# EAGLE schematic GTA04b7 (EAGLE 7.6.0), part 3 of 3
## Sheet 32 of 38
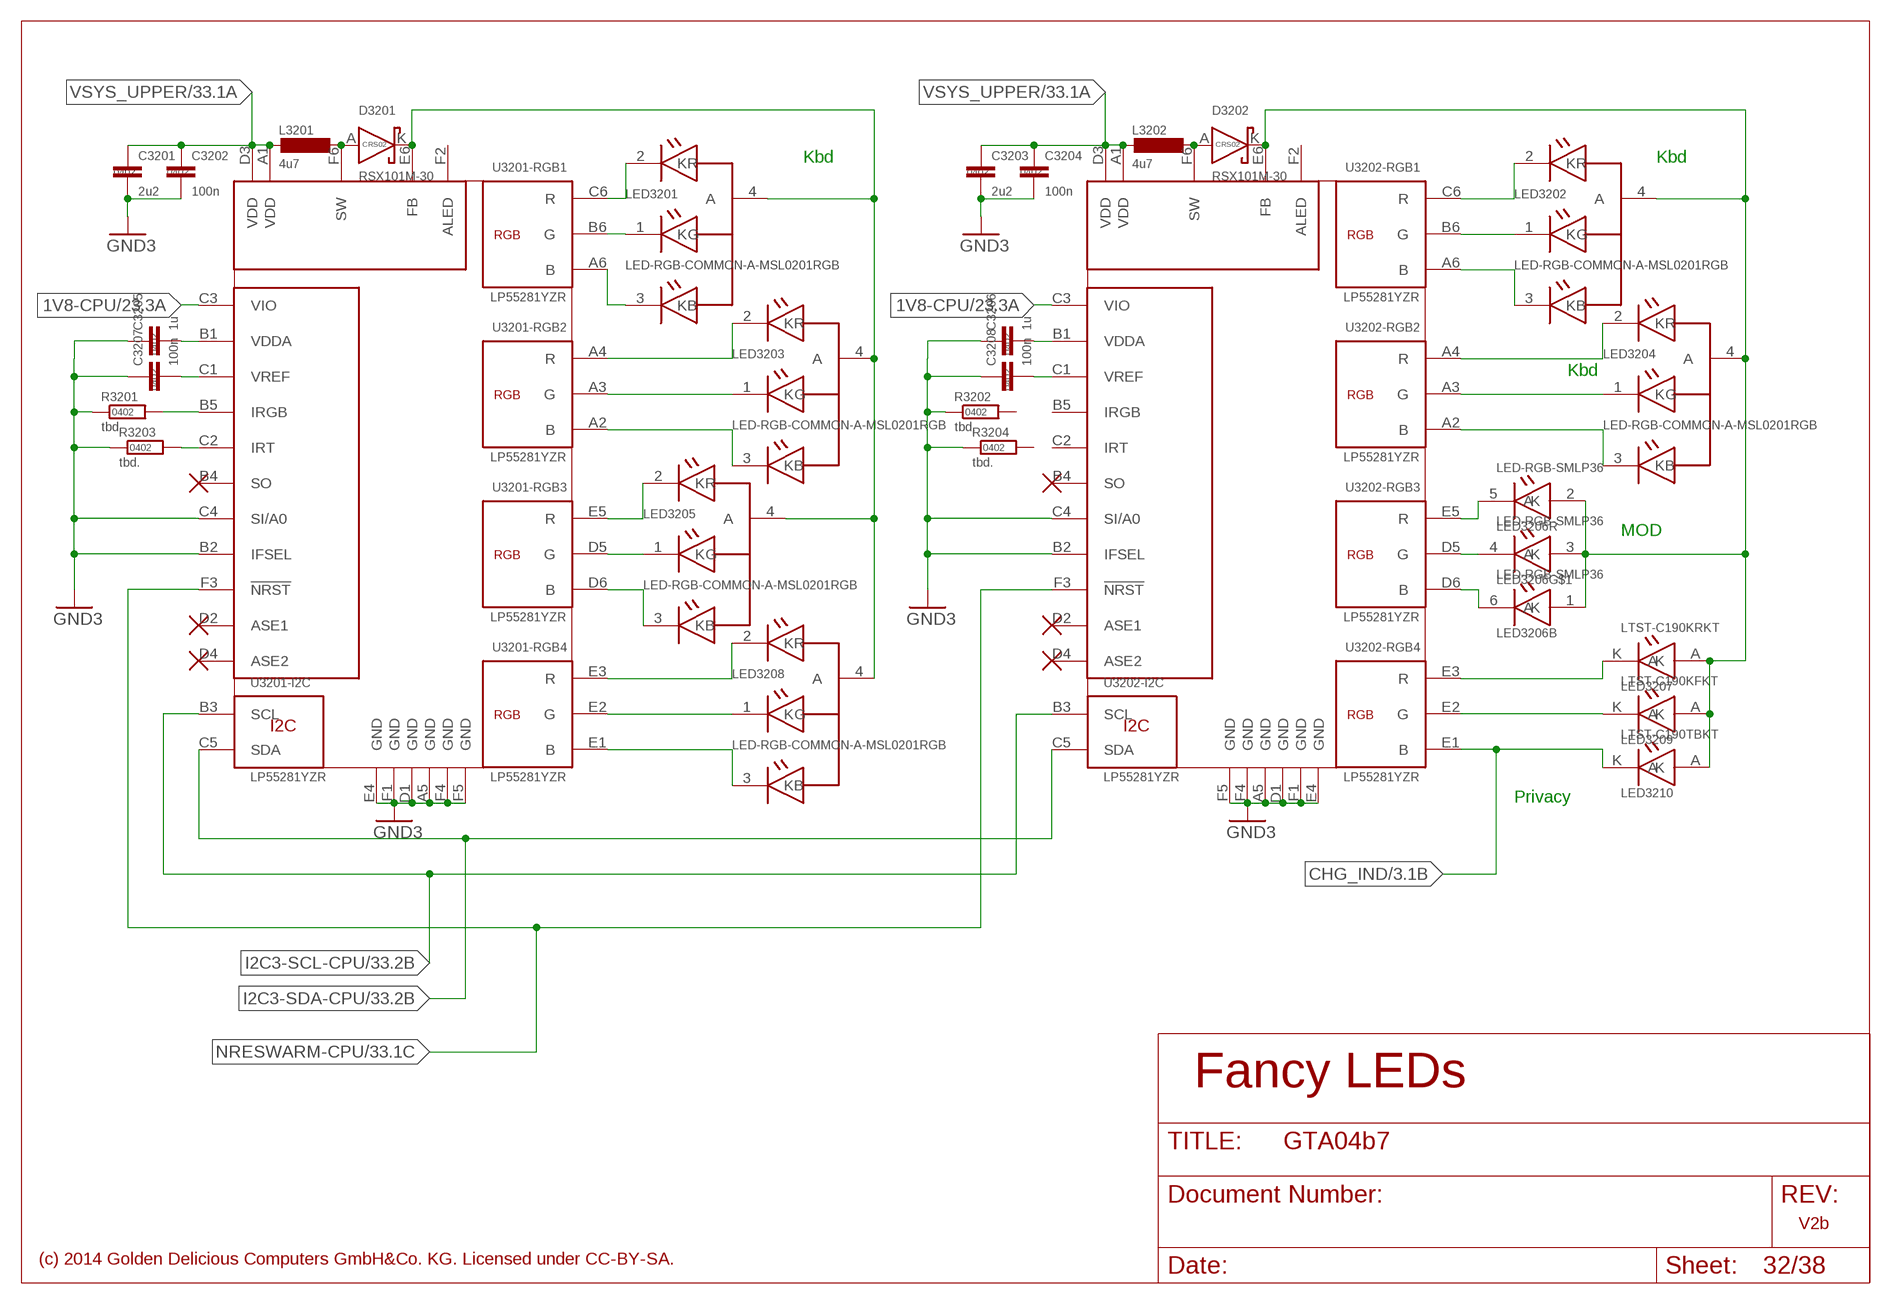
[diagram p35: schematic, sheet 32]

### Parts
C3201  2u2  C0402  [SMD-0402]
C3202  100n  C0402  [SMD-0402]
C3203  2u2  C0402  [SMD-0402]
C3204  100n  C0402  [SMD-0402]
C3205  1u  C0402  [SMD-0402]
C3206  1u  C0402  [SMD-0402]
C3207  100n  C0402  [SMD-0402]
C3208  100n  C0402  [SMD-0402]
D3201  RSX101M-30  D-SCHOTTKY-CRS02  [CRS02]
D3202  RSX101M-30  D-SCHOTTKY-CRS02  [CRS02]
L3201  4u7  L0806  [SMD-0806]
L3202  4u7  L0806  [SMD-0806]
LED3201  LED-RGB-COMMON-A-MSL0201RGB  [MSL0201RGB]
LED3202  LED-RGB-COMMON-A-MSL0201RGB  [MSL0201RGB]
LED3203  LED-RGB-COMMON-A-MSL0201RGB  [MSL0201RGB]
LED3204  LED-RGB-COMMON-A-MSL0201RGB  [MSL0201RGB]
LED3205  LED-RGB-COMMON-A-MSL0201RGB  [MSL0201RGB]
LED3206  LED-RGB-SMLP36  [SMLP36RGB2W3]
LED3207  LTST-C190KRKT  LED-0603  [SMD-0603D]
LED3208  LED-RGB-COMMON-A-MSL0201RGB  [MSL0201RGB]
LED3209  LTST-C190KFKT  LED-0603  [SMD-0603D]
LED3210  LTST-C190TBKT  LED-0603  [SMD-0603D]
R3201  tbd.  R0402  [SMD-0402]
R3202  tbd.  R0402  [SMD-0402]
R3203  tbd.  R0402  [SMD-0402]
R3204  tbd.  R0402  [SMD-0402]
U3201  LP55281YZR  [YZR0036]
U3202  LP55281YZR  [YZR0036]

### Nets
1V8-CPU: U3201.C3(VIO) U3202.C3(VIO) ; also sheet 23,24,25,27,29,30
CHG_IND: LED3210.K U3202.E1(-RGB4:B) ; also sheet 3,20
GND3 [GND]: C3201.2 C3202.2 C3203.2 C3204.2 C3205.1 C3206.1 C3207.1 C3208.1 R3201.1 R3202.1 R3203.1 R3204.1 U3201.A5(GND_RGB1:GND) U3201.B2(IFSEL) U3201.C4(SI/A0) U3201.D1(GNDA:GND) U3201.E4(GND@1:GND) U3201.F1(GND@2:GND) U3201.F4(GND_RGB2:GND) U3201.F5(GND_SW:GND) U3202.A5(GND_RGB1:GND) U3202.B2(IFSEL) U3202.C4(SI/A0) U3202.D1(GNDA:GND) U3202.E4(GND@1:GND) U3202.F1(GND@2:GND) U3202.F4(GND_RGB2:GND) U3202.F5(GND_SW:GND) ; supply symbol labelled GND-3 ; also sheet 22,23,24,25,27,28,29,30,31,33
I2C3-SCL-CPU: U3201.B3(-I2C:SCL) U3202.B3(-I2C:SCL) ; also sheet 26,30,31,33
I2C3-SDA-CPU: U3201.C5(-I2C:SDA) U3202.C5(-I2C:SDA) ; also sheet 26,30,31,33
LED2503: LED3203.1(KG) U3201.A3(-RGB2:G)
LED2504: LED3205.1(KG) U3201.D5(-RGB3:G)
LED2505: LED3208.1(KG) U3201.E2(-RGB4:G)
LED2507: LED3204.1(KG) U3202.A3(-RGB2:G)
N$69: LED3206.4(K) U3202.D5(-RGB3:G)
N$70: LED3206.5(R:K) U3202.E5(-RGB3:R)
N$71: LED3206.6(B:K) U3202.D6(-RGB3:B)
N$85: LED3201.1(KG) U3201.B6(-RGB1:G)
N$89: LED3201.3(KB) U3201.A6(-RGB1:B)
N$90: LED3201.2(KR) U3201.C6(-RGB1:R)
N$91: LED3203.2(KR) U3201.A4(-RGB2:R)
N$94: LED3207.K U3202.E3(-RGB4:R)
N$96: LED3203.3(KB) U3201.A2(-RGB2:B)
N$98: LED3205.2(KR) U3201.E5(-RGB3:R)
N$100: LED3209.K U3202.E2(-RGB4:G)
N$101: LED3205.3(KB) U3201.D6(-RGB3:B)
N$102: LED3208.2(KR) U3201.E3(-RGB4:R)
N$104: LED3208.3(KB) U3201.E1(-RGB4:B)
N$105: LED3202.2(KR) U3202.C6(-RGB1:R)
N$106: LED3202.1(KG) U3202.B6(-RGB1:G)
N$107: LED3202.3(KB) U3202.A6(-RGB1:B)
N$108: LED3204.2(KR) U3202.A4(-RGB2:R)
N$113: LED3204.3(KB) U3202.A2(-RGB2:B)
N$115: D3201.K LED3201.4(A) LED3203.4(A) LED3205.4(A) LED3208.4(A) U3201.E6(FB)
N$116: D3202.K LED3202.4(A) LED3204.4(A) LED3206.1(B:A) LED3206.2(R:A) LED3206.3(A) LED3207.A LED3209.A LED3210.A U3202.E6(FB)
N$117: D3201.A L3201.1 U3201.F6(SW)
N$118: D3202.A L3202.1 U3202.F6(SW)
N$203: C3207.2 U3201.C1(VREF)
N$204: C3205.2 U3201.B1(VDDA)
N$206: R3203.2 U3201.C2(IRT)
N$207: R3201.2 U3201.B5(IRGB)
N$209: C3206.2 U3202.B1(VDDA)
N$210: C3208.2 U3202.C1(VREF)
NRESWARM-CPU: U3201.F3(!NRST) U3202.F3(!NRST) ; also sheet 26,33
VSYS_UPPER: C3201.1 C3202.1 C3203.1 C3204.1 L3201.2 L3202.2 U3201.A1(VDD) U3201.D3(VDD) U3202.A1(VDD) U3202.D3(VDD) ; also sheet 28,31,33
Unconnected: R3202.2 R3204.2 U3201.B4(SO) U3201.D2(ASE1) U3201.D4(ASE2) U3201.F2(ALED) U3202.B4(SO) U3202.B5(IRGB) U3202.C2(IRT) U3202.D2(ASE1) U3202.D4(ASE2) U3202.F2(ALED)

### Notes on the sheet
- Kbd | Kbd
- Kbd
- MOD
- Privacy
- Fancy LEDs
- V2b
- (c) 2014 Golden Delicious Computers GmbH&Co. KG. Licensed under CC-BY-SA.

## Sheet 33 of 38
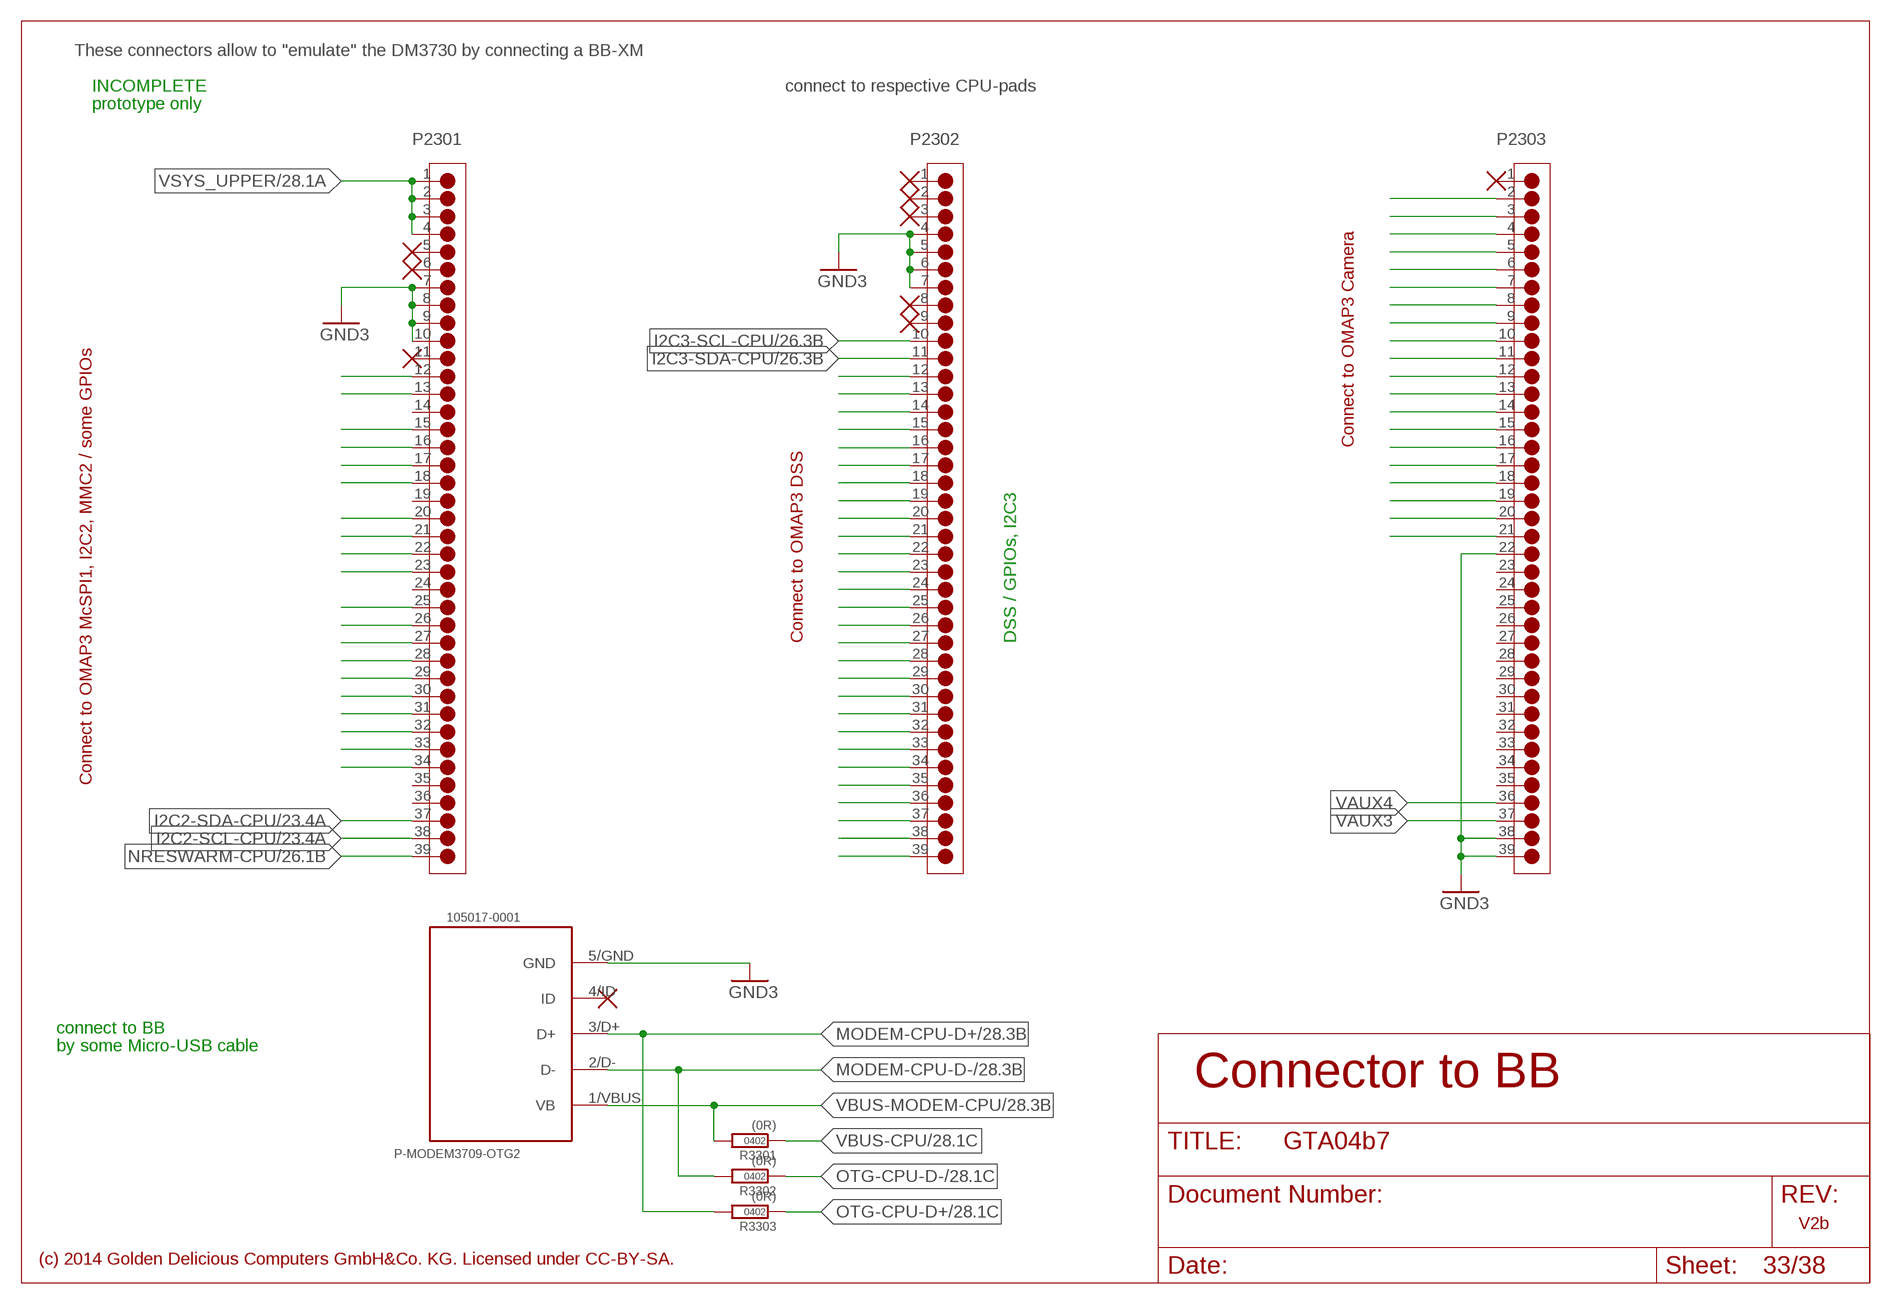
[diagram p36: schematic, sheet 33]

### Parts
P3301  FH23-39S  [FH23-39S-0.3SHW(0.5)]
P3302  FH23-39S  [FH23-39S-0.3SHW(0.5)]
P3303  FH23-39S  [FH23-39S-0.3SHW(0.5)]
P-MODEM3709  105017-0001  USB-AB-NEW-105017-0001  [105017-0001]
R3301  (0R)  R0402  [SMD-0402]  (not fitted in variant Full)  (not fitted in variant BB-XM)
R3302  (0R)  R0402  [SMD-0402]  (not fitted in variant Full)  (not fitted in variant BB-XM)
R3303  (0R)  R0402  [SMD-0402]  (not fitted in variant Full)  (not fitted in variant BB-XM)

### Nets
GND3 [GND]: P3303.22 P3303.38 P3303.39 P-MODEM3709.5/GND(-OTG2:GND) ; supply symbol labelled GND-3 ; also sheet 22,23,24,25,27,28,29,30,31,32
I2C2-SCL-CPU: P3301.38 ; also sheet 23,24,25,26
I2C2-SDA-CPU: P3301.37 ; also sheet 23,24,25,26
I2C3-SCL-CPU: P3302.10 ; also sheet 26,30,31,32
I2C3-SDA-CPU: P3302.11 ; also sheet 26,30,31,32
MODEM-CPU-D+: P-MODEM3709.3/D+(-OTG2:D+) R3303.2 ; also sheet 28
MODEM-CPU-D-: P-MODEM3709.2/D-(-OTG2:D-) R3302.2 ; also sheet 28
N$205: P3303.2
N$216: P3301.7 P3301.8 P3301.9 P3301.10
N$217: P3301.13
N$218: P3301.12
N$219: P3301.16
N$220: P3301.17
N$222: P3301.18
N$223: P3301.15
N$225: P3301.21
N$226: P3301.22
N$227: P3301.23
N$228: P3301.20
N$230: P3301.26
N$231: P3301.27
N$232: P3301.28
N$233: P3301.29
N$234: P3301.30
N$235: P3301.31
N$236: P3301.32
N$237: P3301.33
N$238: P3301.34
N$239: P3301.25
N$242: P3302.4 P3302.5 P3302.6 P3302.7
N$245: P3302.12
N$246: P3302.13
N$247: P3302.14
N$250: P3302.15
N$251: P3302.16
N$252: P3302.17
N$253: P3302.18
N$256: P3302.19
N$257: P3302.20
N$258: P3302.21
N$259: P3302.22
N$260: P3302.23
N$261: P3302.24
N$262: P3302.25
N$263: P3302.26
N$264: P3302.27
N$265: P3302.28
N$266: P3302.29
N$267: P3302.30
N$268: P3302.31
N$270: P3302.32
N$271: P3302.33
N$272: P3302.34
N$273: P3302.35
N$274: P3302.36
N$275: P3302.37
N$276: P3302.38
N$277: P3302.39
N$278: P3303.3
N$279: P3303.4
N$280: P3303.5
N$281: P3303.6
N$282: P3303.7
N$283: P3303.8
N$284: P3303.9
N$285: P3303.10
N$286: P3303.11
N$287: P3303.12
N$288: P3303.13
N$289: P3303.14
N$290: P3303.15
N$291: P3303.16
N$292: P3303.17
N$293: P3303.18
N$294: P3303.19
N$295: P3303.20
N$296: P3303.21
NRESWARM-CPU: P3301.39 ; also sheet 26,32
OTG-CPU-D+: R3303.1 ; also sheet 28
OTG-CPU-D-: R3302.1 ; also sheet 28
VAUX3: P3303.37
VAUX4: P3303.36
VBUS-CPU: R3301.1 ; also sheet 28
VBUS-MODEM-CPU: P-MODEM3709.1/VBUS(-OTG2:VB) R3301.2 ; also sheet 2,28
VSYS_UPPER: P3301.1 P3301.2 P3301.3 P3301.4 ; also sheet 28,31,32
Unconnected: P3301.5 P3301.6 P3301.11 P3301.14 P3301.19 P3301.24 P3301.35 P3301.36 P3302.1 P3302.2 P3302.3 P3302.8 P3302.9 P3303.1 P3303.23 P3303.24 P3303.25 P3303.26 P3303.27 P3303.28 P3303.29 P3303.30 P3303.31 P3303.32 P3303.33 P3303.34 P3303.35 P-MODEM3709.4/ID(-OTG2:ID)

### Notes on the sheet
- These connectors allow to "emulate" the DM3730 by connecting a BB-XM
- INCOMPLETE | connect to respective CPU-pads
- prototype only
- P2301 | P2302 | P2303
- Connect to OMAP3 Camera
- Connect to OMAP3 DSS | DSS / GPIOs, I2C3
- Connect to OMAP3 McSPI1, I2C2, MMC2 / some GPIOs
- connect to BB
- by some Micro-USB cable
- Connector to BB
- V2b
- (c) 2014 Golden Delicious Computers GmbH&Co. KG. Licensed under CC-BY-SA.

## Sheet 34 of 38
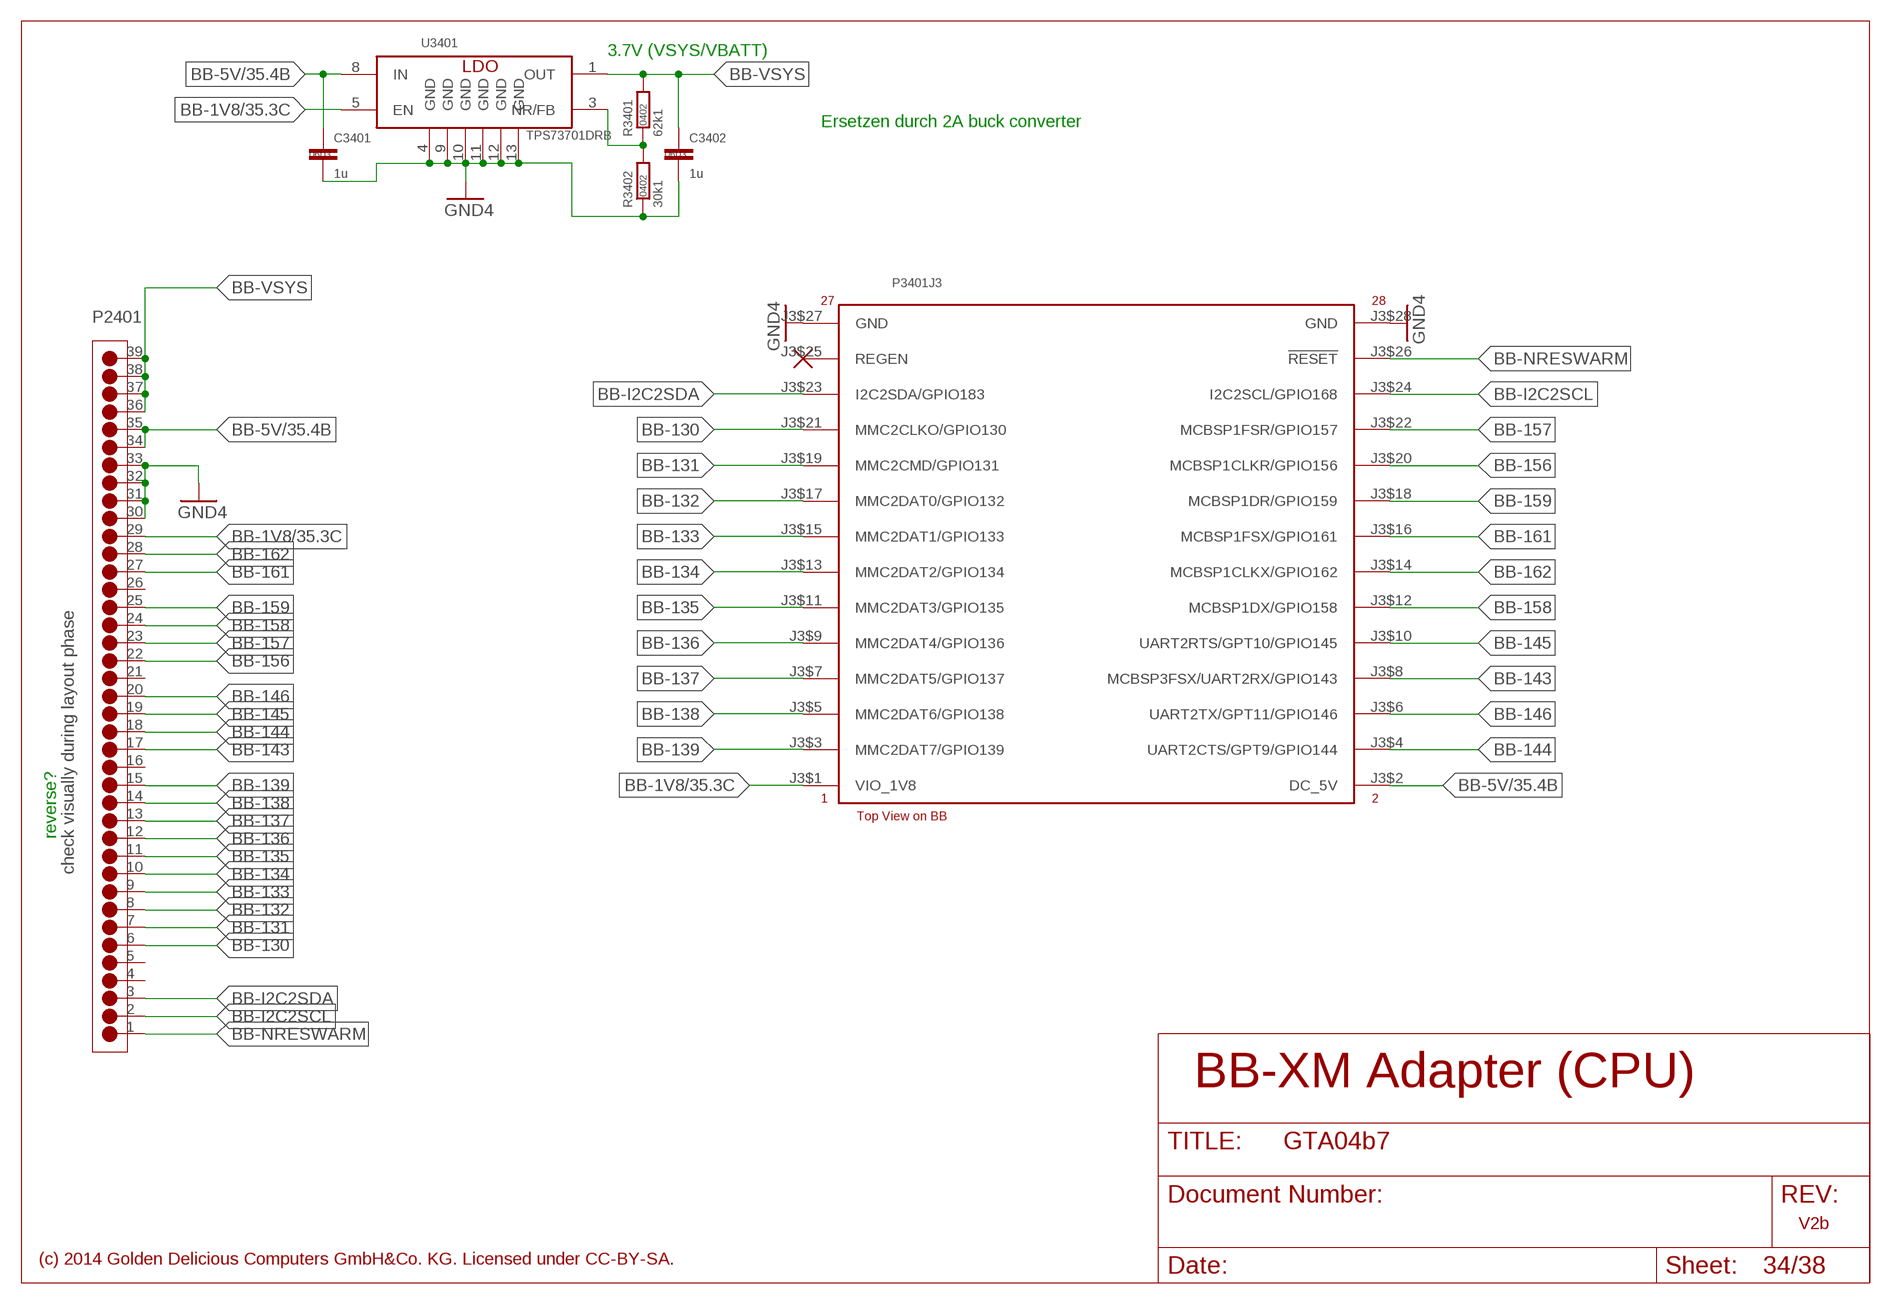
[diagram p37: schematic, sheet 34]

### Parts
C3401  1u  C0603  [SMD-0603]
C3402  1u  C0603  [SMD-0603]
P3401  BEAGLEBOARD  [BEAGLEBOARD]
P3402  FH23-39S  [FH23-39S-0.3SHW(0.5)]
R3401  62k1  R0402  [SMD-0402]
R3402  30k1  R0402  [SMD-0402]
U3401  TPS73701DRB  TPS73733DRB  [SON-3X3]

### Nets
BB-1V8: P3401.J3$1(J3:VIO_1V8) P3402.29 U3401.5(EN) ; also sheet 35
BB-5V: C3401.1 P3401.J3$2(J3:DC_5V) P3402.34 P3402.35 U3401.8(IN) ; also sheet 35
BB-130: P3401.J3$21(J3:MMC2CLKO/GPIO130) P3402.6
BB-131: P3401.J3$19(J3:MMC2CMD/GPIO131) P3402.7
BB-132: P3401.J3$17(J3:MMC2DAT0/GPIO132) P3402.8
BB-133: P3401.J3$15(J3:MMC2DAT1/GPIO133) P3402.9
BB-134: P3401.J3$13(J3:MMC2DAT2/GPIO134) P3402.10
BB-135: P3401.J3$11(J3:MMC2DAT3/GPIO135) P3402.11
BB-136: P3401.J3$9(J3:MMC2DAT4/GPIO136) P3402.12
BB-137: P3401.J3$7(J3:MMC2DAT5/GPIO137) P3402.13
BB-138: P3401.J3$5(J3:MMC2DAT6/GPIO138) P3402.14
BB-139: P3401.J3$3(J3:MMC2DAT7/GPIO139) P3402.15
BB-143: P3401.J3$8(J3:MCBSP3FSX/UART2RX/GPIO143) P3402.17
BB-144: P3401.J3$4(J3:UART2CTS/GPT9/GPIO144) P3402.18
BB-145: P3401.J3$10(J3:UART2RTS/GPT10/GPIO145) P3402.19
BB-146: P3401.J3$6(J3:UART2TX/GPT11/GPIO146) P3402.20
BB-156: P3401.J3$20(J3:MCBSP1CLKR/GPIO156) P3402.22
BB-157: P3401.J3$22(J3:MCBSP1FSR/GPIO157) P3402.23
BB-158: P3401.J3$12(J3:MCBSP1DX/GPIO158) P3402.24
BB-159: P3401.J3$18(J3:MCBSP1DR/GPIO159) P3402.25
BB-161: P3401.J3$16(J3:MCBSP1FSX/GPIO161) P3402.27
BB-162: P3401.J3$14(J3:MCBSP1CLKX/GPIO162) P3402.28
BB-I2C2SCL: P3401.J3$24(J3:I2C2SCL/GPIO168) P3402.2
BB-I2C2SDA: P3401.J3$23(J3:I2C2SDA/GPIO183) P3402.3
BB-NRESWARM: P3401.J3$26(J3:!RESET) P3402.1
BB-VSYS: C3402.1 P3402.36 P3402.37 P3402.38 P3402.39 R3401.2 U3401.1(OUT)
GND4: C3401.2 C3402.2 P3401.J3$27(J3:GND) P3401.J3$28(J3:GND) P3402.30 P3402.31 P3402.32 P3402.33 R3402.1 U3401.4(GND) U3401.9(GND) U3401.10(GND) U3401.11(GND) U3401.12(GND) U3401.13(GND) ; supply symbol labelled GND-4 ; also sheet 35,36
N$68: R3401.1 R3402.2 U3401.3(NR/FB)
Unconnected: P3401.J3$25(J3:REGEN) P3402.4 P3402.5 P3402.16 P3402.21 P3402.26

### Notes on the sheet
- 3.7V (VSYS/VBATT)
- Ersetzen durch 2A buck converter
- P2401
- reverse?
- check visually during layout phase
- BB-XM Adapter (CPU)
- V2b
- (c) 2014 Golden Delicious Computers GmbH&Co. KG. Licensed under CC-BY-SA.

## Sheet 35 of 38
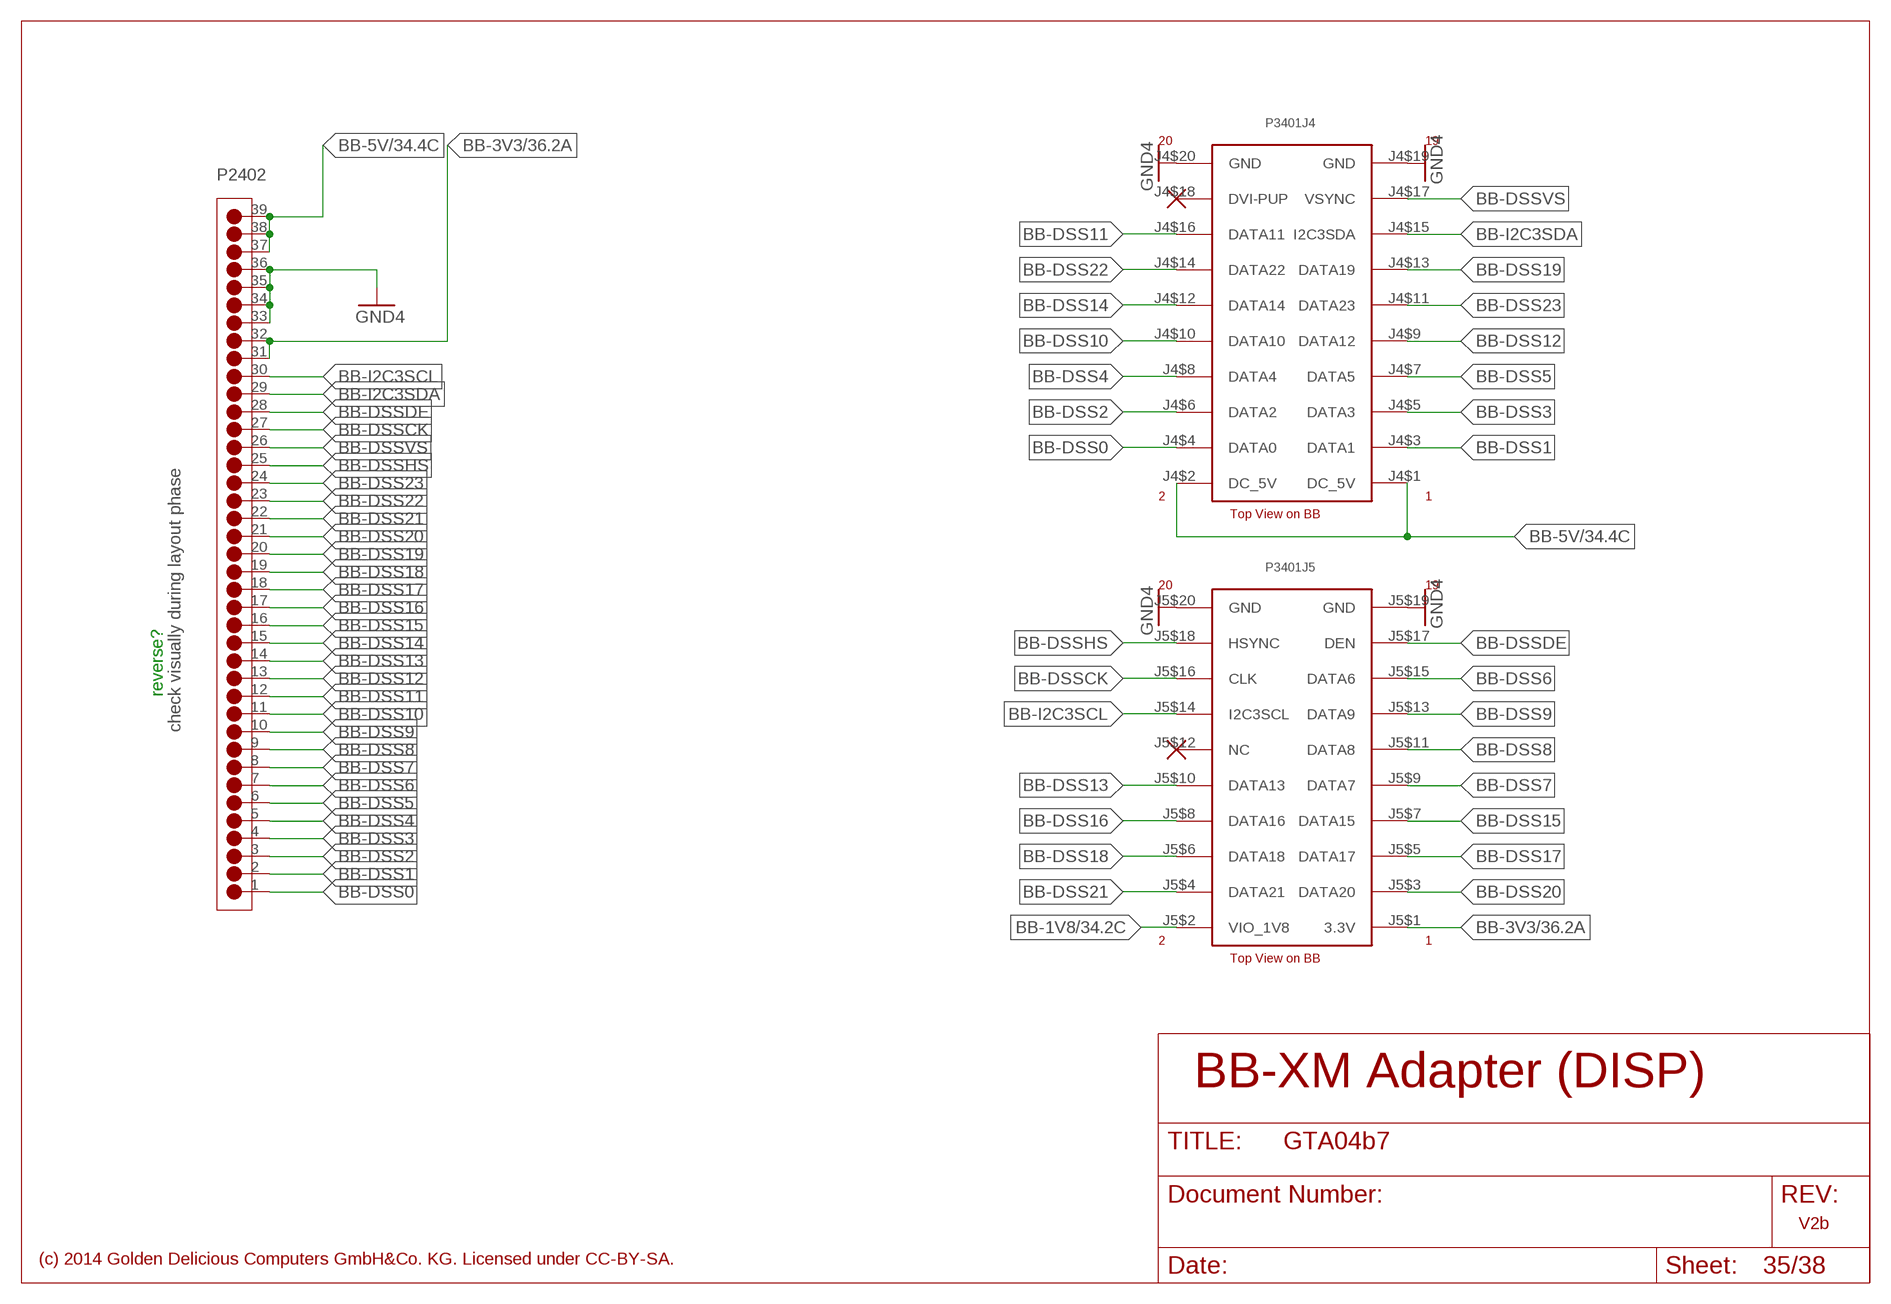
[diagram p38: schematic, sheet 35]

### Parts
P3501  FH23-39S  [FH23-39S-0.3SHW(0.5)]

### Nets
BB-1V8: P3401.J5$2(J5:VIO_1V8) ; also sheet 34
BB-3V3: P3401.J5$1(J5:3.3V) P3501.31 P3501.32 ; also sheet 36
BB-5V: P3401.J4$1(J4:DC_5V) P3401.J4$2(J4:DC_5V) P3501.37 P3501.38 P3501.39 ; also sheet 34
BB-DSS0: P3401.J4$4(J4:DATA0) P3501.1
BB-DSS1: P3401.J4$3(J4:DATA1) P3501.2
BB-DSS2: P3401.J4$6(J4:DATA2) P3501.3
BB-DSS3: P3401.J4$5(J4:DATA3) P3501.4
BB-DSS4: P3401.J4$8(J4:DATA4) P3501.5
BB-DSS5: P3401.J4$7(J4:DATA5) P3501.6
BB-DSS6: P3401.J5$15(J5:DATA6) P3501.7
BB-DSS7: P3401.J5$9(J5:DATA7) P3501.8
BB-DSS8: P3401.J5$11(J5:DATA8) P3501.9
BB-DSS9: P3401.J5$13(J5:DATA9) P3501.10
BB-DSS10: P3401.J4$10(J4:DATA10) P3501.11
BB-DSS11: P3401.J4$16(J4:DATA11) P3501.12
BB-DSS12: P3401.J4$9(J4:DATA12) P3501.13
BB-DSS13: P3401.J5$10(J5:DATA13) P3501.14
BB-DSS14: P3401.J4$12(J4:DATA14) P3501.15
BB-DSS15: P3401.J5$7(J5:DATA15) P3501.16
BB-DSS16: P3401.J5$8(J5:DATA16) P3501.17
BB-DSS17: P3401.J5$5(J5:DATA17) P3501.18
BB-DSS18: P3401.J5$6(J5:DATA18) P3501.19
BB-DSS19: P3401.J4$13(J4:DATA19) P3501.20
BB-DSS20: P3401.J5$3(J5:DATA20) P3501.21
BB-DSS21: P3401.J5$4(J5:DATA21) P3501.22
BB-DSS22: P3401.J4$14(J4:DATA22) P3501.23
BB-DSS23: P3401.J4$11(J4:DATA23) P3501.24
BB-DSSCK: P3401.J5$16(J5:CLK) P3501.27
BB-DSSDE: P3401.J5$17(J5:DEN) P3501.28
BB-DSSHS: P3401.J5$18(J5:HSYNC) P3501.25
BB-DSSVS: P3401.J4$17(J4:VSYNC) P3501.26
BB-I2C3SCL: P3401.J5$14(J5:I2C3SCL) P3501.30
BB-I2C3SDA: P3401.J4$15(J4:I2C3SDA) P3501.29
GND4: P3401.J4$19(J4:GND) P3401.J4$20(J4:GND) P3401.J5$19(J5:GND) P3401.J5$20(J5:GND) P3501.33 P3501.34 P3501.35 P3501.36 ; supply symbol labelled GND-4 ; also sheet 34,36
Unconnected: P3401.J4$18(J4:DVI-PUP) P3401.J5$12(J5:NC)

### Notes on the sheet
- P2402
- reverse?
- check visually during layout phase
- BB-XM Adapter (DISP)
- V2b
- (c) 2014 Golden Delicious Computers GmbH&Co. KG. Licensed under CC-BY-SA.

## Sheet 36 of 38
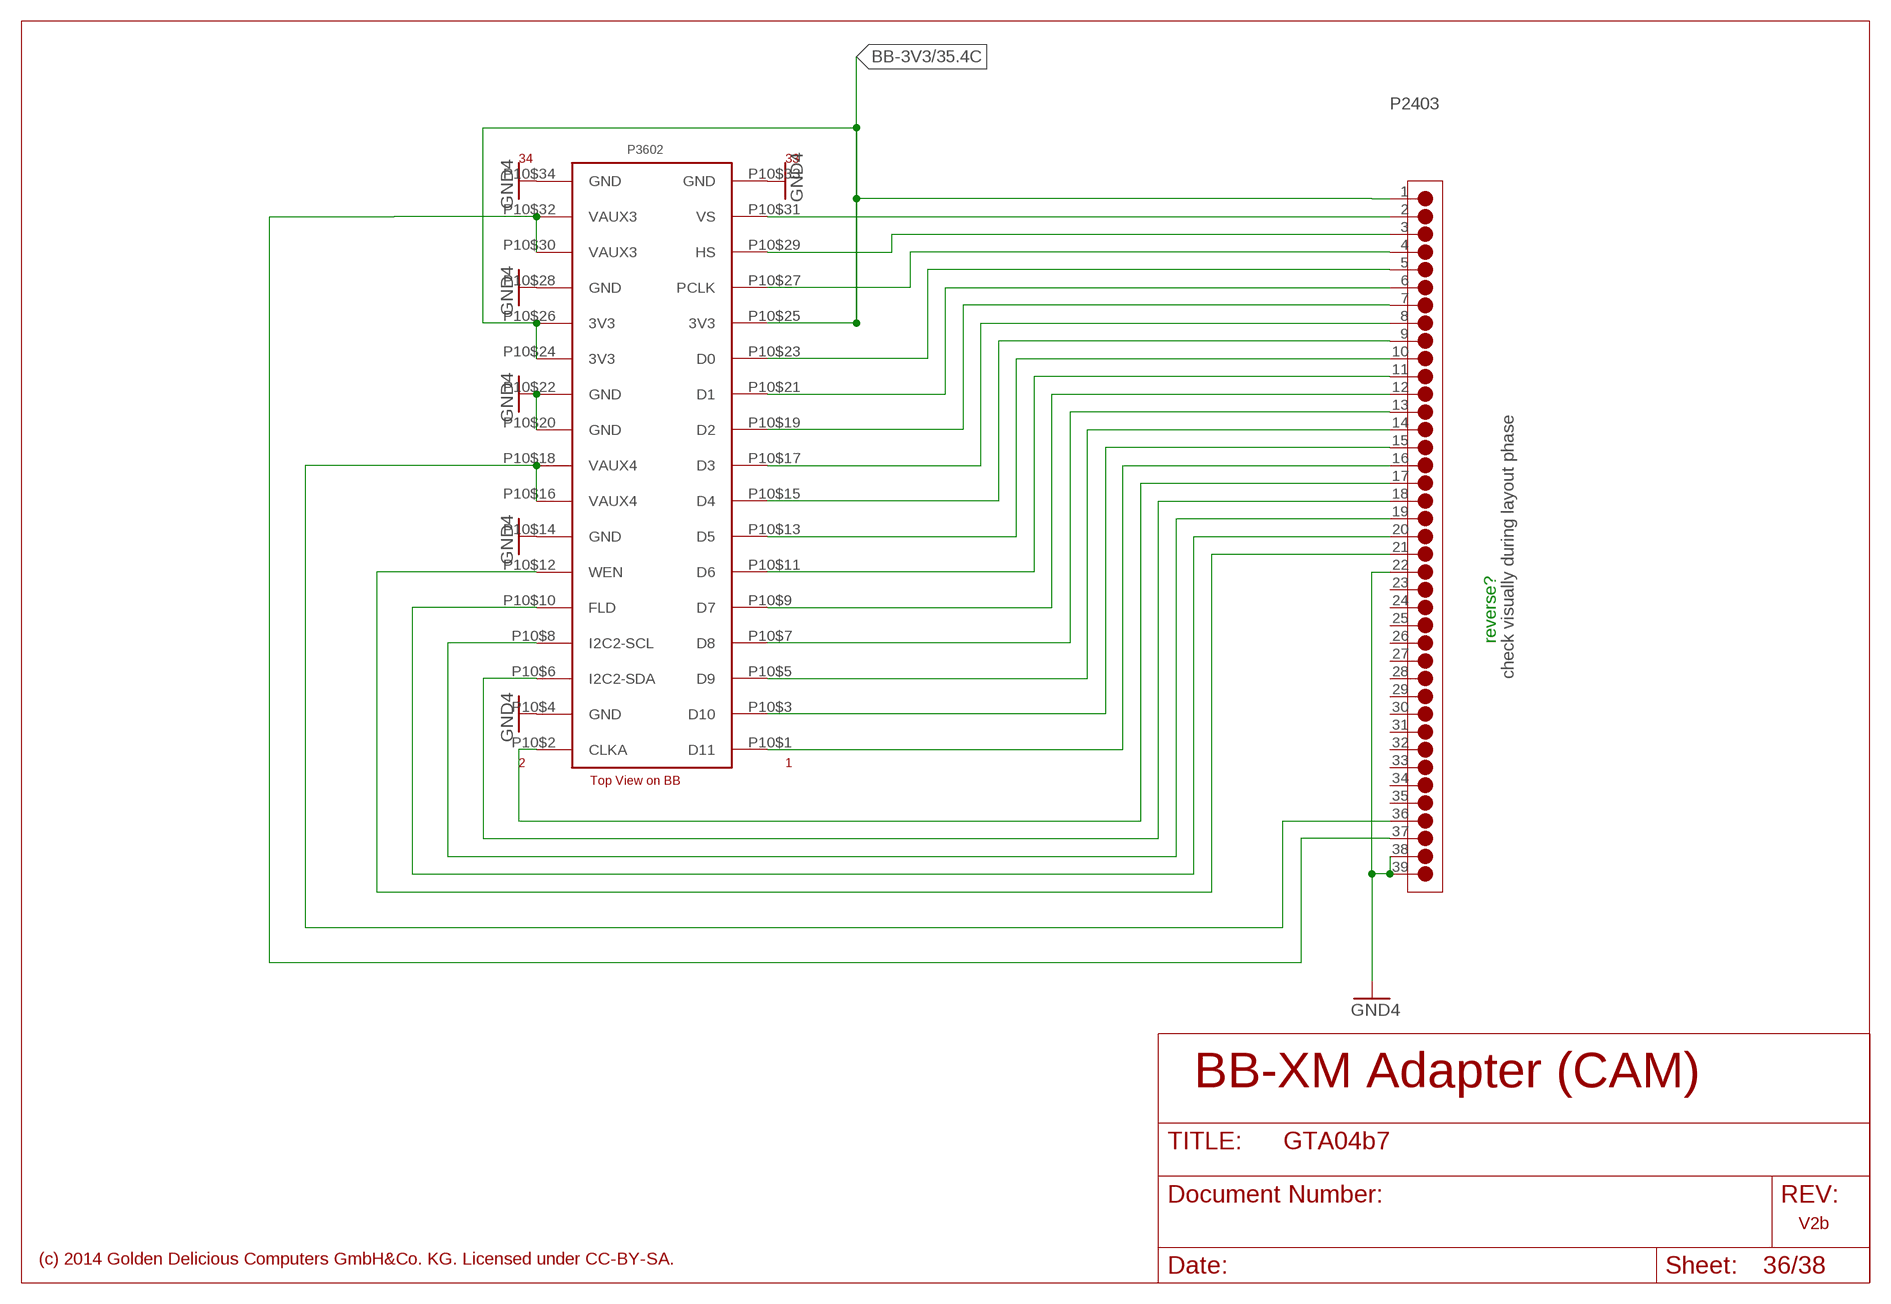
[diagram p39: schematic, sheet 36]

### Parts
P3601  FH23-39S  [FH23-39S-0.3SHW(0.5)]
P3602  BEAGLEBOARD-XM-CAMERA  [BEAGLEBOARD-XM-CAM]  (not fitted in variant Full)

### Nets
BB-3V3: P3601.1 P3602.P10$24(3V3) P3602.P10$25(3V3) P3602.P10$26(3V3) ; also sheet 35
GND4: P3601.22 P3601.38 P3601.39 P3602.P10$4(GND) P3602.P10$14(GND) P3602.P10$20(GND) P3602.P10$22(GND) P3602.P10$28(GND) P3602.P10$33(GND) P3602.P10$34(GND) ; supply symbol labelled GND-4 ; also sheet 34,35
N$54: P3601.37 P3602.P10$30(VAUX3) P3602.P10$32(VAUX3)
N$56: P3601.36 P3602.P10$16(VAUX4) P3602.P10$18(VAUX4)
N$180: P3601.4 P3602.P10$27(PCLK)
N$181: P3601.5 P3602.P10$23(D0)
N$182: P3601.6 P3602.P10$21(D1)
N$183: P3601.7 P3602.P10$19(D2)
N$184: P3601.8 P3602.P10$17(D3)
N$185: P3601.9 P3602.P10$15(D4)
N$186: P3601.10 P3602.P10$13(D5)
N$187: P3601.11 P3602.P10$11(D6)
N$188: P3601.12 P3602.P10$9(D7)
N$189: P3601.13 P3602.P10$7(D8)
N$190: P3601.14 P3602.P10$5(D9)
N$191: P3601.15 P3602.P10$3(D10)
N$192: P3601.16 P3602.P10$1(D11)
N$193: P3601.3 P3602.P10$29(HS)
N$194: P3602.P10$31(VS)
N$195: P3601.17 P3602.P10$2(CLKA)
N$196: P3601.18 P3602.P10$6(I2C2-SDA)
N$197: P3601.19 P3602.P10$8(I2C2-SCL)
N$198: P3601.20 P3602.P10$10(FLD)
N$199: P3601.21 P3602.P10$12(WEN)
Unconnected: P3601.2 P3601.23 P3601.24 P3601.25 P3601.26 P3601.27 P3601.28 P3601.29 P3601.30 P3601.31 P3601.32 P3601.33 P3601.34 P3601.35

### Notes on the sheet
- P2403
- reverse?
- check visually during layout phase
- BB-XM Adapter (CAM)
- V2b
- (c) 2014 Golden Delicious Computers GmbH&Co. KG. Licensed under CC-BY-SA.

## Sheet 37 of 38
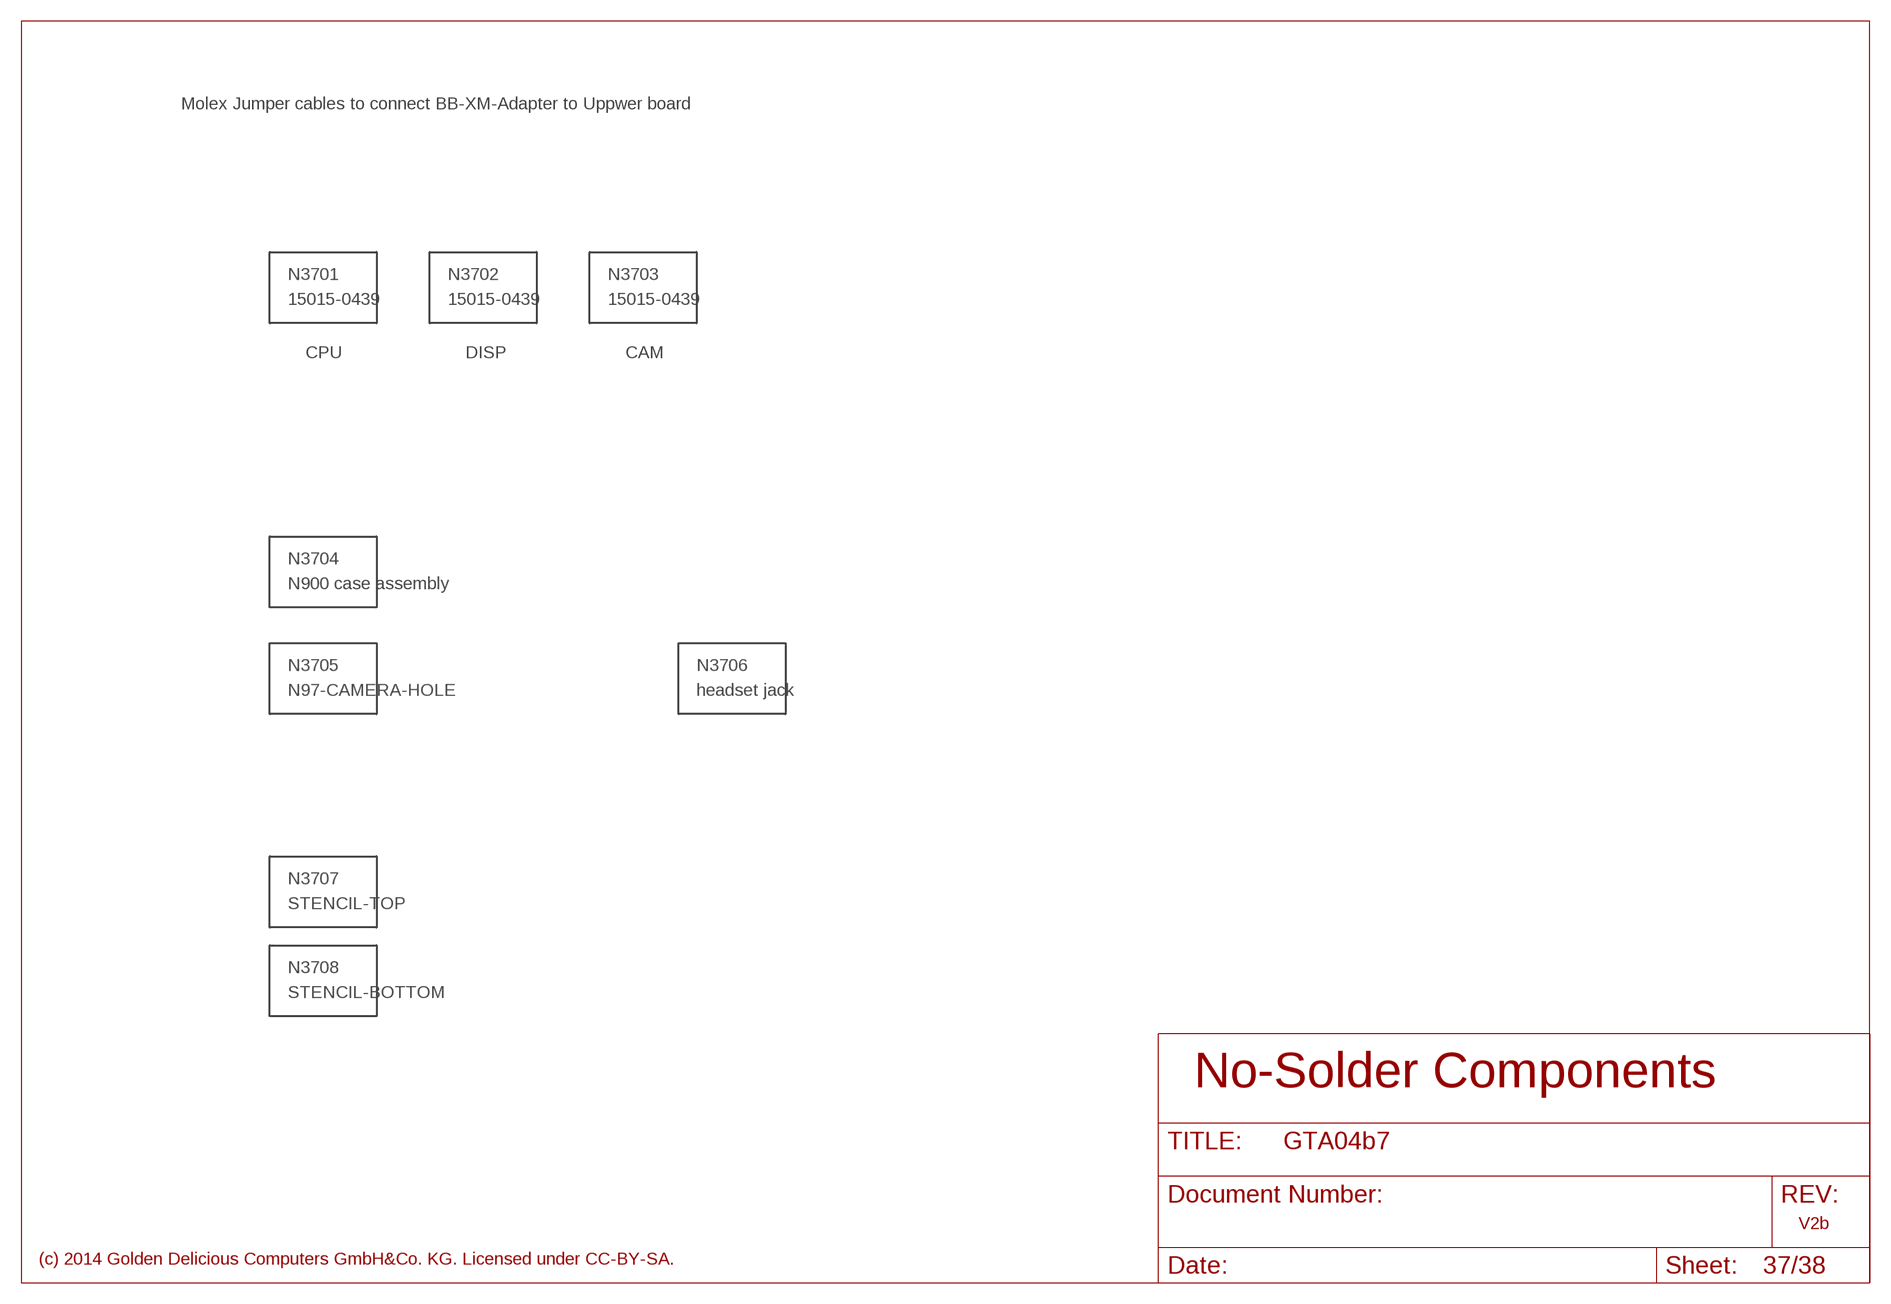
[diagram p40: schematic, sheet 37]

### Parts
N3701  15015-0439  MECHANICAL  [NONE]  (not fitted in variant Full)  (not fitted in variant BB-XM)
N3702  15015-0439  MECHANICAL  [NONE]  (not fitted in variant Full)  (not fitted in variant BB-XM)
N3703  15015-0439  MECHANICAL  [NONE]  (not fitted in variant Full)  (not fitted in variant BB-XM)
N3704  N900 case assembly  MECHANICAL  [NONE]  (not fitted in variant Full)  (not fitted in variant BB-XM)
N3705  N97-CAMERA-HOLE  N900-CAMERAN97-CAMERA-SPACE  [N97-CAMERA-SPACE]
N3706  headset jack  MECHANICAL  [NONE]  (not fitted in variant Full)  (not fitted in variant BB-XM)
N3707  STENCIL-TOP  MECHANICAL-STENCIL  [GDC-STENCIL]  (not fitted in variant Full)  (not fitted in variant BB-XM)
N3708  STENCIL-BOTTOM  MECHANICAL-STENCIL  [GDC-STENCIL]  (not fitted in variant Full)  (not fitted in variant BB-XM)

### Notes on the sheet
- Molex Jumper cables to connect BB-XM-Adapter to Uppwer board
- CPU | DISP | CAM
- No-Solder Components
- V2b
- (c) 2014 Golden Delicious Computers GmbH&Co. KG. Licensed under CC-BY-SA.

## Sheet 38 of 38
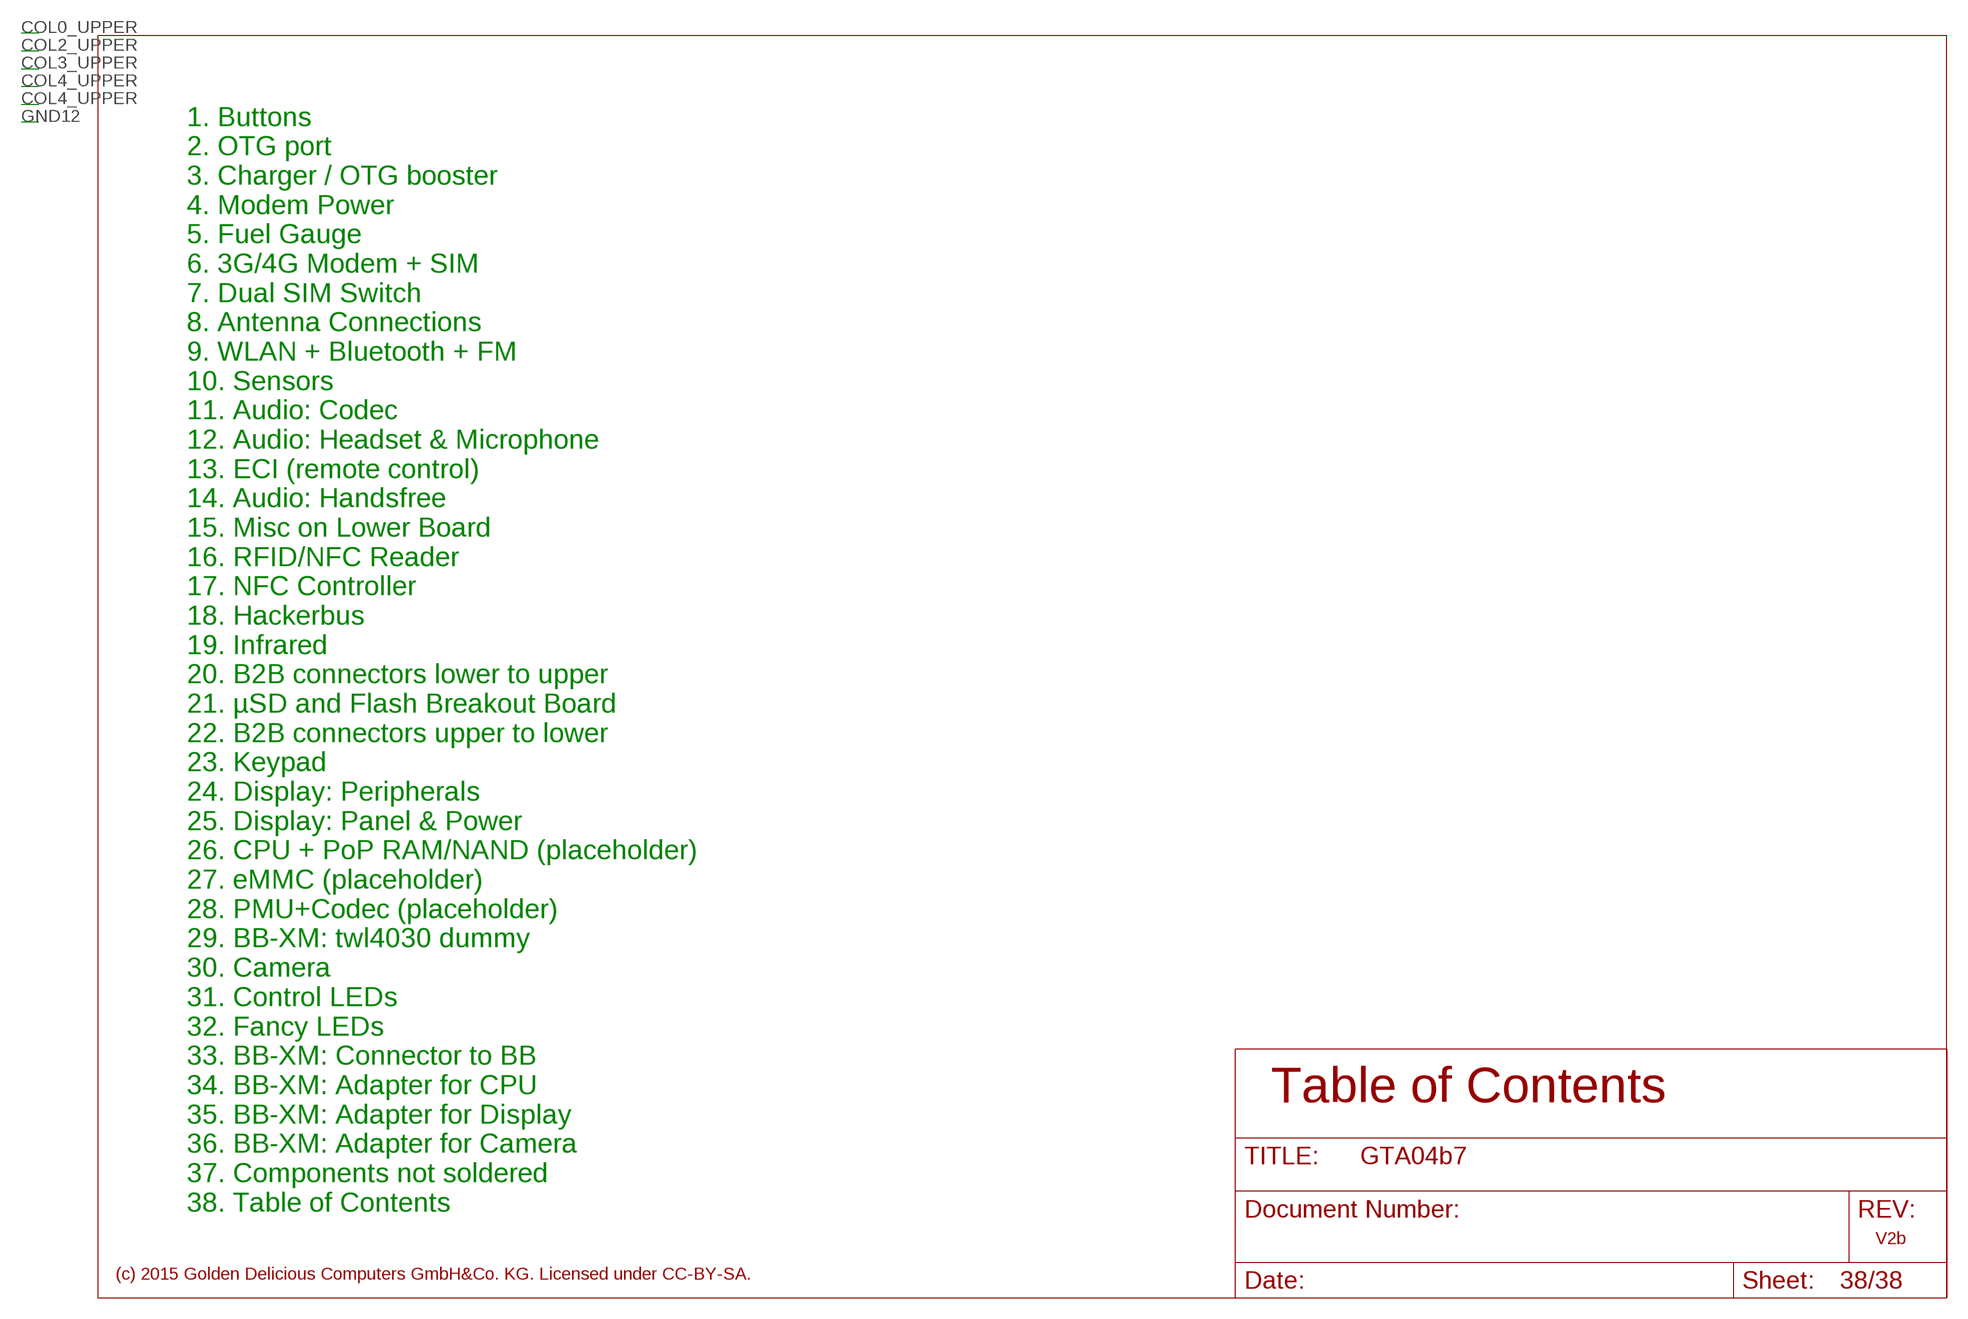
[diagram p41: schematic, sheet 38]

### Notes on the sheet
- 1. Buttons
  2. OTG port
  3. Charger / OTG booster
  4. Modem Power
  5. Fuel Gauge
  6. 3G/4G Modem + SIM
  7. Dual SIM Switch
  8. Antenna Connections
  9. WLAN + Bluetooth + FM
  10. Sensors
  11. Audio: Codec
  12. Audio: Headset & Microphone
  13. ECI (remote control)
  14. Audio: Handsfree
  15. Misc on Lower Board
  16. RFID/NFC Reader
  17. NFC Controller
  18. Hackerbus
  19. Infrared
  20. B2B connectors lower to upper
  21. µSD and Flash Breakout Board
  22. B2B connectors upper to lower
  23. Keypad
  24. Display: Peripherals
  25. Display: Panel & Power
  26. CPU + PoP RAM/NAND (placeholder)
  27. eMMC (placeholder)
  28. PMU+Codec (placeholder)
  29. BB-XM: twl4030 dummy
  30. Camera
  31. Control LEDs
  32. Fancy LEDs
  33. BB-XM: Connector to BB
  34. BB-XM: Adapter for CPU
  35. BB-XM: Adapter for Display
  36. BB-XM: Adapter for Camera
  37. Components not soldered
  38. Table of Contents
- Table of Contents
- V2b
- (c) 2015 Golden Delicious Computers GmbH&Co. KG. Licensed under CC-BY-SA.

## Power pins joined to a net without a drawn wire
AVSS1: U2803.E5(AUDIO:AVSS1) U2803.J4(AUDIO:AVSS1) U2803.J6(AUDIO:AVSS1) U2803.J7(AUDIO:AVSS1) U2803.J8(AUDIO:AVSS1)
AVSS2: U2803.R10(AUDIO:AVSS2)
AVSS3: U2803.M15(AUDIO:AVSS3)
AVSS4: U2803.C7(AUDIO:AVSS4)
CAP_VDD_DSI: U2502.AH20(POWER:CAP_VDD_DSI)
CAP_VDD_SRAM_CORE: U2502.L21(POWER:CAP_VDD_SRAM_CORE)
CAP_VDD_SRAM_MPU_IVA: U2502.V4(POWER:CAP_VDD_SRAM_MPU_IVA)
CAP_VDD_WKUP: U2502.AA15(POWER:CAP_VDD_WKUP)
CP.GND: U2803.R6(USB-POWER:CP.GND)
CP.IN: U2803.R7(USB-POWER:CP.IN)
DGND: U2803.H9(POWER:DGND) U2803.H10(POWER:DGND) U2803.H11(POWER:DGND) U2803.H13(POWER:DGND)
EXP: U501.EXP
GND: U901.1(POWER:GND) U901.3(POWER:GND) U901.6(POWER:GND) U901.11(POWER:GND) U901.18(POWER:GND) U901.25(POWER:GND) U901.27(POWER:GND) U901.29(POWER:GND) U901.31(POWER:GND) U901.32(POWER:GND) U901.37(POWER:GND) U901.40(POWER:GND) U901.46(POWER:GND) U901.48(POWER:GND) U901.49(POWER:GND) U901.50(POWER:GND) U901.59(POWER:GND) U901.60(POWER:GND) U901.66(POWER:GND) U901.67(POWER:GND) U901.68(POWER:GND) U901.69(POWER:GND)
GND.LEFT: U2803.C9(AUDIO:GND.LEFT) U2803.C10(AUDIO:GND.LEFT)
GND.RIGHT: U2803.C11(AUDIO:GND.RIGHT) U2803.C12(AUDIO:GND.RIGHT)
IO.1P8: U2803.C8(MISC:IO.1P8)
LEDGND: U2803.F16(MISC:LEDGND)
MICBIAS.GND: U2803.D3(AUDIO:MICBIAS.GND)
POP_DDR_VDD_FT: U2502.A15(POWER:POP_DDR_VDD_FT) U2502.AE28(POWER:POP_DDR_VDD_FT) U2502.AF28(POWER:POP_DDR_VDD_FT) U2502.J28(POWER:POP_DDR_VDD_FT) U2502.M1(POWER:POP_DDR_VDD_FT)
POP_FLASH_VDD_FT: U2502.AA1(POWER:POP_FLASH_VDD_FT) U2502.AF1(POWER:POP_FLASH_VDD_FT) U2502.AH10(POWER:POP_FLASH_VDD_FT) U2502.AH15(POWER:POP_FLASH_VDD_FT) U2502.N1(POWER:POP_FLASH_VDD_FT)
POP_VSS_FT: U2502.AA2(POWER:POP_VSS_FT) U2502.AF2(POWER:POP_VSS_FT) U2502.AF27(POWER:POP_VSS_FT) U2502.AG10(POWER:POP_VSS_FT) U2502.AG15(POWER:POP_VSS_FT) U2502.B15(POWER:POP_VSS_FT) U2502.J27(POWER:POP_VSS_FT) U2502.M2(POWER:POP_VSS_FT) U2502.M26(POWER:POP_VSS_FT) U2502.N2(POWER:POP_VSS_FT)
SHIELD: P-MODEM3709.SH1(-M2:SHIELD) P-MODEM3709.SH2(-M3:SHIELD) P-MODEM3709.SH3(-M4:SHIELD) P-MODEM3709.SH4(-M1:SHIELD) P-SIM701.S1(-GND1:SHIELD) P-SIM701.S2(-GND2:SHIELD) U1902.S(SHIELD)
VAUX1.OUT: U2803.M2(POWER:VAUX1.OUT)
VAUX2.OUT: U2803.M3(POWER:VAUX2.OUT)
VAUX3.OUT: U2803.G16(POWER:VAUX3.OUT)
VAUX4.IN: U2803.B2(POWER:VAUX4.IN)
VAUX4.OUT: U2803.B3(POWER:VAUX4.OUT)
VAUX12S.IN: U2803.L1(POWER:VAUX12S.IN)
VBAT: U901.9(POWER:VBAT) U2803.R5(CHARGER:VBAT)
VBAT.LEFT: U2803.D9(AUDIO:VBAT.LEFT) U2803.D10(AUDIO:VBAT.LEFT)
VBAT.RIGHT: U2803.D11(AUDIO:VBAT.RIGHT) U2803.D12(AUDIO:VBAT.RIGHT)
VBAT.USB: U2803.R9(USB-POWER:VBAT.USB)
VDAC.IN: U2803.K1(POWER:VDAC.IN)
VDAC.OUT2: U2803.L2(POWER:VDAC.OUT2)
VDD: U1901.8(VDD)
VDD1.FB: U2803.E13(POWER:VDD1.FB)
VDD1.GND: U2803.B15(POWER:VDD1.GND) U2803.C15(POWER:VDD1.GND) U2803.C16(POWER:VDD1.GND)
VDD1.IN: U2803.D14(POWER:VDD1.IN) U2803.E14(POWER:VDD1.IN) U2803.E15(POWER:VDD1.IN)
VDD1.SW: U2803.C14(POWER:VDD1.SW) U2803.D15(POWER:VDD1.SW) U2803.D16(POWER:VDD1.SW)
VDD2.FB: U2803.N13(POWER:VDD2.FB)
VDD2.GND: U2803.R15(POWER:VDD2.GND) U2803.T14(POWER:VDD2.GND)
VDD2.IN: U2803.P14(POWER:VDD2.IN) U2803.R13(POWER:VDD2.IN)
VDD2.SW: U2803.R14(POWER:VDD2.SW) U2803.T13(POWER:VDD2.SW)
VDD_CORE: U2502.AC4(POWER:VDD_CORE) U2502.AE9(POWER:VDD_CORE) U2502.AE18(POWER:VDD_CORE) U2502.AE19(POWER:VDD_CORE) U2502.AE24(POWER:VDD_CORE) U2502.D8(POWER:VDD_CORE) U2502.D9(POWER:VDD_CORE) U2502.D15(POWER:VDD_CORE) U2502.D22(POWER:VDD_CORE) U2502.D23(POWER:VDD_CORE) U2502.E25(POWER:VDD_CORE) U2502.H4(POWER:VDD_CORE) U2502.J4(POWER:VDD_CORE) U2502.J18(POWER:VDD_CORE) U2502.J19(POWER:VDD_CORE) U2502.J20(POWER:VDD_CORE) U2502.K18(POWER:VDD_CORE) U2502.K20(POWER:VDD_CORE) U2502.L25(POWER:VDD_CORE) U2502.M19(POWER:VDD_CORE) U2502.M25(POWER:VDD_CORE) U2502.N19(POWER:VDD_CORE) U2502.N20(POWER:VDD_CORE) U2502.P20(POWER:VDD_CORE) U2502.T19(POWER:VDD_CORE) U2502.U19(POWER:VDD_CORE) U2502.U20(POWER:VDD_CORE) U2502.V20(POWER:VDD_CORE) U2502.W18(POWER:VDD_CORE) U2502.W20(POWER:VDD_CORE) U2502.Y16(POWER:VDD_CORE) U2502.Y18(POWER:VDD_CORE) U2502.Y19(POWER:VDD_CORE) U2502.Y20(POWER:VDD_CORE)
VDD_LDO_IN_CLASS1P5: U901.8(POWER:VDD_LDO_IN_CLASS1P5)
VDD_MPU_IVA: U2502.J9(POWER:VDD_MPU_IVA) U2502.J10(POWER:VDD_MPU_IVA) U2502.J11(POWER:VDD_MPU_IVA) U2502.J14(POWER:VDD_MPU_IVA) U2502.J15(POWER:VDD_MPU_IVA) U2502.K11(POWER:VDD_MPU_IVA) U2502.K13(POWER:VDD_MPU_IVA) U2502.K14(POWER:VDD_MPU_IVA) U2502.L9(POWER:VDD_MPU_IVA) U2502.L10(POWER:VDD_MPU_IVA) U2502.M9(POWER:VDD_MPU_IVA) U2502.M10(POWER:VDD_MPU_IVA) U2502.N10(POWER:VDD_MPU_IVA) U2502.R9(POWER:VDD_MPU_IVA) U2502.R10(POWER:VDD_MPU_IVA) U2502.T9(POWER:VDD_MPU_IVA) U2502.T10(POWER:VDD_MPU_IVA) U2502.U10(POWER:VDD_MPU_IVA) U2502.W9(POWER:VDD_MPU_IVA) U2502.W11(POWER:VDD_MPU_IVA) U2502.W12(POWER:VDD_MPU_IVA) U2502.W15(POWER:VDD_MPU_IVA) U2502.Y9(POWER:VDD_MPU_IVA) U2502.Y10(POWER:VDD_MPU_IVA) U2502.Y11(POWER:VDD_MPU_IVA) U2502.Y14(POWER:VDD_MPU_IVA) U2502.Y15(POWER:VDD_MPU_IVA)
VDDA_DAC: U2502.V25(POWER:VDDA_DAC)
VDDS: U2502.AD3(POWER:VDDS) U2502.AD4(POWER:VDDS) U2502.AE8(POWER:VDDS) U2502.AE16(POWER:VDDS) U2502.AE23(POWER:VDDS) U2502.AF8(POWER:VDDS) U2502.AF16(POWER:VDDS) U2502.AF23(POWER:VDDS) U2502.AG27(POWER:VDDS) U2502.F25(POWER:VDDS) U2502.F26(POWER:VDDS) U2502.W4(POWER:VDDS)
VDDS_CSI2: U2502.AG20(POWER:VDDS_CSI2)
VDDS_CSIB: U2502.H28(POWER:VDDS_CSIB)
VDDS_DPLL_DLL: U2502.K15(POWER:VDDS_DPLL_DLL)
VDDS_DPLL_PER: U2502.AA16(POWER:VDDS_DPLL_PER)
VDDS_DSI: U2502.AG21(POWER:VDDS_DSI)
VDDS_MEM: U2502.A5(POWER:VDDS_MEM) U2502.A8(POWER:VDDS_MEM) U2502.A12(POWER:VDDS_MEM) U2502.A18(POWER:VDDS_MEM) U2502.A22(POWER:VDDS_MEM) U2502.AH6(POWER:VDDS_MEM) U2502.B5(POWER:VDDS_MEM) U2502.B8(POWER:VDDS_MEM) U2502.B12(POWER:VDDS_MEM) U2502.B18(POWER:VDDS_MEM) U2502.B22(POWER:VDDS_MEM) U2502.C16(POWER:VDDS_MEM) U2502.C28(POWER:VDDS_MEM) U2502.D16(POWER:VDDS_MEM) U2502.F1(POWER:VDDS_MEM) U2502.F2(POWER:VDDS_MEM) U2502.G28(POWER:VDDS_MEM) U2502.J1(POWER:VDDS_MEM) U2502.J2(POWER:VDDS_MEM) U2502.R4(POWER:VDDS_MEM) U2502.U1(POWER:VDDS_MEM)
VDDS_MMC1: U2502.K25(POWER:VDDS_MMC1)
VDDS_SDI: U2502.AE27(POWER:VDDS_SDI)
VDDS_SIM: U2502.P25(POWER:VDDS_SIM)
VDDS_SRAM: U2502.W16(POWER:VDDS_SRAM)
VDDS_WKUP_BG: U2502.AA14(POWER:VDDS_WKUP_BG)
VEXT: M601.M5(POWER:VEXT)
VINT.IN: U2803.K15(POWER:VINT.IN)
VINTANA1.OUT: U2803.H3(POWER:VINTANA1.OUT)
VINTANA2.OUT: U2803.B6(POWER:VINTANA2.OUT) U2803.J2(POWER:VINTANA2.OUT)
VINTDIG.OUT: U2803.L16(POWER:VINTDIG.OUT)
VIO: U901.10(POWER:VIO)
VIO.FB: U2803.N3(POWER:VIO.FB)
VIO.GND: U2803.R2(POWER:VIO.GND) U2803.T3(POWER:VIO.GND)
VIO.IN: U2803.P3(POWER:VIO.IN) U2803.R4(POWER:VIO.IN)
VIO.SW: U2803.R3(POWER:VIO.SW) U2803.T4(POWER:VIO.SW)
VMMC1.IN: U2803.C1(POWER:VMMC1.IN)
VMMC1.OUT: U2803.C2(POWER:VMMC1.OUT)
VMMC2.IN: U2803.A3(POWER:VMMC2.IN)
VMMC2.OUT: U2803.A4(POWER:VMMC2.OUT)
VPLL1.OUT: U2803.H14(POWER:VPLL1.OUT)
VPLLA3R.IN: U2803.H15(POWER:VPLLA3R.IN)
VREF: U2803.N16(MISC:VREF)
VREG_IN: U2402.12(-CHIP:VREG_IN)
VREG_OUT: U2402.13(-CHIP:VREG_OUT)
VRTC.OUT: U2803.K16(POWER:VRTC.OUT)
VSDI.CSI.OUT: U2803.J15(POWER:VSDI.CSI.OUT)
VSIM: U702.6(-H2:VSIM)
VSIM.OUT: U2803.K2(POWER:VSIM.OUT)
VSS: U1901.4(VSS) U2502.A3(POWER:VSS) U2502.A26(POWER:VSS) U2502.AC25(POWER:VSS) U2502.AC26(POWER:VSS) U2502.AE12(POWER:VSS) U2502.AE20(POWER:VSS) U2502.AF12(POWER:VSS) U2502.AF20(POWER:VSS) U2502.AG2(POWER:VSS) U2502.AG3(POWER:VSS) U2502.AG6(POWER:VSS) U2502.B2(POWER:VSS) U2502.B27(POWER:VSS) U2502.C7(POWER:VSS) U2502.C10(POWER:VSS) U2502.C13(POWER:VSS) U2502.C19(POWER:VSS) U2502.C22(POWER:VSS) U2502.D7(POWER:VSS) U2502.D10(POWER:VSS) U2502.D13(POWER:VSS) U2502.D19(POWER:VSS) U2502.D21(POWER:VSS) U2502.E3(POWER:VSS) U2502.E4(POWER:VSS) U2502.G27(POWER:VSS) U2502.J3(POWER:VSS) U2502.J12(POWER:VSS) U2502.J13(POWER:VSS) U2502.J16(POWER:VSS) U2502.J17(POWER:VSS) U2502.K9(POWER:VSS) U2502.K10(POWER:VSS) U2502.K12(POWER:VSS) U2502.K16(POWER:VSS) U2502.K17(POWER:VSS) U2502.K19(POWER:VSS) U2502.L19(POWER:VSS) U2502.L20(POWER:VSS) U2502.L26(POWER:VSS) U2502.M20(POWER:VSS) U2502.N9(POWER:VSS) U2502.P3(POWER:VSS) U2502.P4(POWER:VSS) U2502.P9(POWER:VSS) U2502.P10(POWER:VSS) U2502.P19(POWER:VSS) U2502.R19(POWER:VSS) U2502.R20(POWER:VSS) U2502.R26(POWER:VSS) U2502.T20(POWER:VSS) U2502.U2(POWER:VSS) U2502.U9(POWER:VSS) U2502.V9(POWER:VSS) U2502.V10(POWER:VSS) U2502.V19(POWER:VSS) U2502.W3(POWER:VSS) U2502.W10(POWER:VSS) U2502.W13(POWER:VSS) U2502.W14(POWER:VSS) U2502.W17(POWER:VSS) U2502.W19(POWER:VSS) U2502.W25(POWER:VSS) U2502.Y12(POWER:VSS) U2502.Y13(POWER:VSS) U2502.Y17(POWER:VSS) U2502.Y25(POWER:VSS)
VSS_CSI2: U2502.AG16(POWER:VSS_CSI2)
VSS_CSIB: U2502.M28(POWER:VSS_CSIB)
VSS_DSI: U2502.AH21(POWER:VSS_DSI)
VSS_SDI: U2502.AA26(POWER:VSS_SDI)
VSSA_DAC: U2502.Y26(POWER:VSSA_DAC)

## Library data of the parts
1V8-OUT3709 CTS3709 DCD3709 DSR3709 DTR3709 RING3709 RTS3709 RX3709 TX3709 = OpenPhoenux:TEST-POINT: Test Point; MICRO-VIA: 2:P
A901 = OpenPhoenux:ANTENNA: Chip Antenna (single ended)
ANT-901 = OpenPhoenux:2PIN
B1/CTL3709 B2/CTL2301 B3/\\3709 B4/A3709 B5/Q3709 B6/2301 B7/3709 B8/3709 B9/SPC2301 B10/OK3709 B11/ALT3709 B12/FN3709 B13/SPC2301 B14/SPC2301 B15/M3709 B16/,3709 B17/PGDN3709 B18/END3709 B19/LEFT3709 B20/RGHT3709 B21/DEL3709 B22/3709 B23/TAB3709 B24/BSP3709 B25/RET3709 B26/PIPE3709 B27/PGUP3709 B28/HOME3709 B29/UP3709 B30/DN3709 B31/ALT2301 B32/SHLCK3709 B33/ESC3709 B60/^2301 B60/^3709 B69/O3709 B70/P3709 B79/2301 B80/2301 = OpenPhoenux:BUTTON: Generic push-button (e.g. maeander)
BATT+3709 BATT-GND3709 BATT-ID3709 BGND3709 CD3709 D+3709 D-3709 GPIO601 HS-1201-HS-1206 LC_IND3709 MCBSP4-CLK3709 MCBSP4-DR3709 MCBSP4-DX3709 MCBSP4-FSX3709 PGM3709 PWR_IND3709 SPKRL+3709 SPKRL-3709 SPKRR+3709 SPKRR-3709 STATUS3709 TP2 TP1401 TP1402 VBATT3709 VIBRA+3709 VIBRA-3709 WAKEUP3709 = OpenPhoenux:TEST-POINT: Test Point
C201 C602 C603 C605 C606 C608 C609 C611 C612 C801-C812 C901-C903 C905-C908 C1001 C1002 C1004 C1005 C1007-C1012 C1101-C1111 C1201-C1217 C1402-C1411 C1601-C1628 C1701-C1703 C1901-C1904 C2101 C2102 C2402-C2405 C2410 C2411 C3001-C3007 C3101-C3103 C3201-C3208 = OpenPhoenux:C: Capacitor (no polarity); SIZE: 0402
C301-C305 C401-C406 C501-C506 C904 C1003 C1006 C1401 C2103-C2105 C2301 C2401 C2406-C2409 C3401 C3402 = OpenPhoenux:C: Capacitor (no polarity); SIZE: 0603
C601 C604 C607 C610 = OpenPhoenux:C: Capacitor (no polarity); SIZE: 0805
C2501 C2502 = OpenPhoenux:C: Capacitor (no polarity)
C2801 = OpenPhoenux:C-POL: Capacitor (with polarity); SIZE: 1206
C2802 = OpenPhoenux:C: Capacitor (no polarity); SIZE: 1210
D101-D106 D501 D502 D901 D1201-D1205 D1401-D1404 D2101 = OpenPhoenux:V5.5MLA0603N: LittleFuse Varistor V5.5MLA0603N (N means special nickel plate for better reflow soldering)
D1701 D1902 LED2102 LED3207 LED3209 LED3210 = OpenPhoenux:LED: Single LED
D1901 = OpenPhoenux:VEMD2023SLX01: Silicon PIN Photodiode
D2102 D2501 D3201 D3202 = OpenPhoenux:D-SCHOTTKY: 30V,1A,Schottky Diode; SIZE: CRS02
D2301-D2308 = OpenPhoenux:D: Generic diode; SIZE: 0603
D2502 = OpenPhoenux:D-ZENER: Z-Diode; SIZE: 0603
FMTX-ANT3709 GPS-ANT3709 GPS-GND3709 WLAN-ANT901 WLAN-ANT3709 WLAN-GND901 WLAN-GND3709 WWAN3709 WWAN-GND801 WWAN-GND802 = OpenPhoenux:CONNECT-POINT
FMTX-ANT-GND3709 G1501-G1503 G2201-G2209 = OpenPhoenux:SHIELD: GND connection
L301 = OpenPhoenux:L: Inductor; SIZE: 1212
L801-L804 L902 L1202-L1206 L1401-L1404 L3001 = OpenPhoenux:L: Inductor; SIZE: 0402
L901 L1601 L1602 = OpenPhoenux:L: Inductor; SIZE: 0603
L1101-L1103 L1201 L1207 L2401 L2402 L2501 = OpenPhoenux:L: Inductor
L2101 L2102 = OpenPhoenux:L: Inductor; SIZE: 0805
L2502-L2504 = OpenPhoenux:COMMON-MODE-FILTER
L3201 L3202 = OpenPhoenux:L: Inductor; SIZE: 0806
LED2101 LED2103 = OpenPhoenux:CLN6A: Cree® CLN6A-WKW/MKW High Power LEDs
LED3101 LED3102 LED3206 = OpenPhoenux:LED-RGB
LED3201-LED3205 LED3208 = OpenPhoenux:LED-RGB-COMMON-A: RGB LED with common Anode
M601 = OpenPhoenux:PHS8: Cinterion UMTS/LTE LGA PHS8
M901 = OpenPhoenux:WL18XXMOD: TI WIFI/BT modules: WL1801 WL1831 WL1835 WL1837
M902 U901 = OpenPhoenux:WG7351: JorJin WL1271L (WiLink6) Module WLAN/BT/FM
M2401 M2402 = OpenPhoenux:SPK0415HM4H: Digital High-SNR Microphone
N2901 = OpenPhoenux:0R: Describe single node point for handling analog ground
N3001 N3705 = OpenPhoenux:N900-CAMERA
N3701-N3704 N3706-N3708 U807 U903 U1201 U2601 U2801 U3003 = OpenPhoenux:MECHANICAL: Component not soldered to PCB
P1501 P2101 = OpenPhoenux:FX6-20: Hirose FX6 - 0.8mm Pitch Stacking Height 5 to 9mm Connector - 20 pin
P2001 P2002 P2201 P2202 = OpenPhoenux:DF40C-60D?-0.4V: Hirose 2x30 pin B2B connector
P3001 = OpenPhoenux:DF37NB-20DS-0.4/N97CAM: N97 camera module (with DF37 connector)
P3301-P3303 P3402 P3501 P3601 = OpenPhoenux:FH23-39S
P3401 = OpenPhoenux:BEAGLEBOARD: BeagleBoard expansion connectors J3, J4 and J5
P3602 = OpenPhoenux:BEAGLEBOARD-XM-CAMERA: Camera interface of BeagleBoard XM
P-BATT3709 = OpenPhoenux:BATT-3PIN: 3 pin battery connector
P-CAMERA3709 = OpenPhoenux:BUTTON-2LEVEL: Pushbutton with two levels (Camera shutter)
P-DISP3709 = OpenPhoenux:N900-DISPLAY: N900 display module (multi-functional FFC connector)
P-DRX3709 P-GNSS3709 P-INT801 = OpenPhoenux:PLUG: Antenna plug (SMD)
P-HS3709 = OpenPhoenux:N900-HEADSET: RX51 Headset Jack
P-LOCK3709 P-MINUS3709 P-ON3709 P-PLUS3709 = OpenPhoenux:BUTTON-GND: Pushbutton with 2 grounded shield/mounting pads
P-MICRO-SD3709 = OpenPhoenux:SD-SLOT+CD
P-MODEM3709 = OpenPhoenux:USB-AB-NEW: Molex USB-OTG mini plug
P-OTG3709 = OpenPhoenux:USB-AB: Molex USB-OTG mini plug
P-SIM701 P-SIM3709 = OpenPhoenux:SIM-SLOT-6PIN+CD: SIM Slot with 6 contact pins
P-WWAN3709 = OpenPhoenux:MM8430-2600RA1: SWD-Socket with Antenna switch
R201-R203 R301-R303 R401-R410 R501 R502 R504-R508 R601-R603 R701 R801-R807 R901-R911 R1001 R1002 R1101-R1111 R1201-R1208 R1301-R1311 R1601 R1701-R1704 R1901-R1908 R2101 R2401-R2403 R2501 R2502 R3001-R3004 R3201-R3204 R3301-R3303 R3401 R3402 = OpenPhoenux:R: Resistor; SIZE: 0402
R503 R2503 R2504 R2801 = OpenPhoenux:R: Resistor; SIZE: 0603
S1001 = OpenPhoenux:LIS302: Accelerometer LIS302
S1002 = OpenPhoenux:BMG160: Bosch BMG160 Gyroscope
S1003 = OpenPhoenux:BMC150: Bosch Sensortec BMC150
S1004 = OpenPhoenux:BNO055: Bosch BNO055 Intelligent 9-axis absolute orientation sensor
S1005 = OpenPhoenux:BMP180: Bosch Barometer BMP180
SPKR-L3709 SPKR-R3709 = OpenPhoenux:SPEAKER: Speaker module
T601 T1902 = OpenPhoenux:T-NPN-DUAL: Dual NPN transistors with bias resistors 10k/47k
T1901 = OpenPhoenux:T-PMOS: Single P-Channel (? 2.5V) Specified PowerTrench MOSFET
TP1 TP3-TP22 TP25 TP26 = OpenPhoenux:PIN: Test Point
U201 = OpenPhoenux:IP4220: USB2.0 compliant ESD filter; 1pF; 4 ports
U301 = OpenPhoenux:BQ2429X: BQ24295/6/7 (small differences in pins and external inductor needed)
U401 U904 = OpenPhoenux:TPS22964C
U402-U404 = OpenPhoenux:INA231: Current sensor with I2C
U501 = OpenPhoenux:BQ27X00
U502 = OpenPhoenux:BQ27421G1
U601 = OpenPhoenux:ESDA6V1-5P6: TransilTM array for ESD protection
U701 U702 = OpenPhoenux:FSA2866: Dual-Host / Dual-SIM Card Crosspoint Analog Switch
U801 = OpenPhoenux:BGM1034N7: GPS and GLONASS Front-End Module
U802 = OpenPhoenux:PE2459: Peregrine PE4259 SPDT High Power UltraCMOS? 10 MHz ? 3.0 GHz RF Switch
U803 = OpenPhoenux:CPL-WBF-00D3: Wide band directional coupler with ISO port
U804 U805 = OpenPhoenux:LMV221SD: 50 MHz to 3.5 GHz 40 dB Logarithmic Power Detector for CDMA and WCDMA
U806 = OpenPhoenux:LTC5508: 300MHz to 7GHz RF Power Detector with Buffered Output in SC70 Package
U902 = OpenPhoenux:SI4721: Silicon Labs Si4720/4721 Digital FM RX/TX
U1101 = OpenPhoenux:TLV320AIC34: TLV320AIC34 FOUR-CHANNEL, LOW-POWER AUDIO CODEC FOR PORTABLE AUDIO/TELEPHONY
U1202 = OpenPhoenux:TPA6130A2: TPA6130A2 138-mW DIRECTPATHTM STEREO HEADPHONE AMPLIFIER WITH I2C VOLUME CONTROL
U1203 = OpenPhoenux:TS3A225E
U1301 = OpenPhoenux:TLV70230: LDO 3.0V, 300 mA, Capless, active high Enable
U1302 = OpenPhoenux:TLV1702: Dual Comparator with Open Collector output
U1401 = OpenPhoenux:TPA2012D2: 2.1 W/CH STEREO FILTER-FREE CLASS-D AUDIO POWER AMPLIFIER
U1601 = RFID:TRF796X: TRF7960RHB
U1701 = OpenPhoenux:MKL16Z32VFM4: Freescale Kinetis 48 MHz Cortex-M0+ Based Microcontroller
U1901 = OpenPhoenux:TLV7256I: Texas Instruments Dual Comparator
U1902 = OpenPhoenux:RPM973-H11E2A: ROHM IrDA 1.4 SIR/MIR/FIR transceiver
U2101 = OpenPhoenux:MLX90248: Micropower & Omnipolar Hall Switch
U2102 = OpenPhoenux:SFH7741: Proximity Sensor
U2103 = OpenPhoenux:ADP1653: Compact, High Efficiency, High Power, Flash/Torch LED Driver with Dual Interface
U2301 = OpenPhoenux:TCA8418: I2C-Keypad controller
U2401 = OpenPhoenux:TSC2007I: Touch screen controller with I2C Note: real package is smaller
U2402 = OpenPhoenux:CRTOUCH: Freescale CRTouch touch controller
U2501 = OpenPhoenux:TPS61041: LED stepup converter (alternative: Fairchild FAN5330)
U2502 = OpenPhoenux:OMAP3530: ARM Coretx Applications Processor Texas Instruments OMAP3530/25 600-MHz ARM Cortex-A8 Core; MICRO-VIA-OFF: 1:B2,1:N2,1:U2,2:Y2,1:AA2,2:AB2,2:AC2,2:AD2,1:AG2,1:J3,1:P3,2:V3,1:W3,3:Y3,2:AA3,3:AB3,1:AC3,2:AD3,1:AE3,2:AF3,2:AF5,2:AF6,1:AG6,3:AF7,3:AG7,1:P8,2:W8,1:Y8,3:AA8,2:AF8,1:AG8,1:W9,2:AA9,3:AF9,1:AA10,3:AF10,1:AG10,1:AA11,1:AA12,1:AF12,1:C13,2:AF13,2:AG13,1:AA14,3:AF14,2:AG14,1:B15,2:AA15,2:AF15,1:AG15,1:C16,1:AA16,1:AF16,1:B17,2:AA17,3:AG17,4:AA18,1:AF18,2:AG18,1:C19,1:H19,2:AA19,2:AF19,3:AG19,1:H20,1:AA20,2:AF20,1:AG20,2:H21,2:J21,1:L21,3:N21,2:P21,1:R21,3:T21,2:U21,1:V21,1:W21,2:Y21,2:AF21,2:AG21,1:C22,3:AF22,1:AG22,1:B23,2:C23,1:AF23,2:AG23,2:B24,2:C24,2:AF24,2:AG24,1:B25,3:C25,2:B26,2:C26,3:D26,2:E26,3:H26,1:J26,1:K26,1:L26,2:N26,2:R26,4:T26,7:U26,4:V26,2:W26,3:AB26,3:AD26,2:AE26,2:AF26,1:B27,1:C27,2:D27,1:G27,1:J27,1:K27,2:L27,1:M27,2:N27,3:T27,3:U27,3:V27,1:W27,1:Y27,2:AA27,2:AB27,3:AC27,2:AD27,2:AE27,1:AF27,1:AG27,1:K10,1:A18,1:K13,1:Y16,1:Y18,1:U10,1:AE25,1:K17,1:K19,2:AE17,1:D28,3:T28,1:R28,2:U28,2:U25,3:V28,1:Y4,1:AD28,1:AA25,3:AB25,3:AD25,2:AE10,3:AE4,2:AE5,2:D25,1:D24,2:AF1,1:W16,2:AA4,1:AC1,1:AH24,2:L28,3:T25,1:AH9,3:AE6,1:AD1,1:H25,1:A23,1:AH17,1:M21,1:A24,1:V25
U2701 = OpenPhoenux:EMMC: eMMC in 169 BGA or 153 BGA (Hynix)
U2802 = OpenPhoenux:USB332X: ULPI USB-PHY driver SMSC USB332x; MICRO-VIA: 1:B2,B3,B4,C2,C4,D2,D3,D4,2:C3,D1,E1
U2803 = OpenPhoenux:TPS65950: Power Controller for OMAP Texas Instruments TPS65950; MICRO-VIA-X: 1:B2,2:C2,1:F2,2:G2,1:K2,3:L2,2:N2,2:B3,1:D3,3:E3,4:F3,3:G3,3:H3,1:J3,3:K3,4:L3,3:M3,1:N3,1:R3,1:B4,3:C4,1:E5,1:P5,1:B6,2:P6,2:R6,1:C7,5:G7,3:H7,5:K7,3:P7,1:R7,1:C8,2:G8,4:H8,2:K8,3:P8,2:J9,3:K9,3:P9,1:B10,3:G10,4:J10,5:K10,3:P10,2:R10,1:B11,3:P11,2:R11,1:C12,1:B13,2:C13,3:P13,2:R13,1:C14,4:F14,4:G14,2:H14,2:J14,5:K14,4:L14,1:M14,2:N14,1:R14,1:D14,1:D15,2:F15,2:G15,1:K15,1:L15,2:P14,1:P15,1:R15,1:T10,2:T11,1:D12,1:K11,1:A3,1:C1,1:E15,1:H15,2:P2,4:E4,3:D4,2:H4,4:K4,3:N10,2:F10,3:P12,4:N12,3:K6,4:G4,2:N11,1:N9,2:N8,2:N4,3:N6,5:H6,4:F4,3:F7,2:G6,4:L7,5:L9,5:L8,1:G1,2:D6,1:D5,2:E2,4:L13,2:M13,3:K13,4:J13,4:G13,4:F13,5:N7,5:L4,3:N5,4:M4,2:M2,1:R8,3:N13,2:B9,1:A15,1:R12,1:B16,1:P1,1:B5
U2901 U2902 = OpenPhoenux:TPS73630: LDO 3.0V, 400 mA, Capless, active high Enable
U3001 U3002 = OpenPhoenux:TS3DS26227: HIGH-BANDWIDTH DUAL SPDT DIFFERENTIAL SIGNAL SWITCH WITH INPUT LOGIC TRANSLATION
U3101 = OpenPhoenux:LP55231: 9 fancy LED driver with I2C
U3201 U3202 = OpenPhoenux:LP55281: Quad RGB Driver
U3401 = OpenPhoenux:TPS73733: 3.3V, 1A LDO; MICRO-VIA: 2:9
VIBRA3709 = OpenPhoenux:SPEAKER-SHIELD: Vibramotor Speaker with additional Shield/Mounting pad
X901 = OpenPhoenux:TCXO: TCXO (sine wave output)
X1601 = OpenPhoenux:XTAL-4: XTAL with GND pads

## Net classes
2 50 Ohm: width 0.27 mm, clearance 0.27 mm
3 90 Ohm: width 0.15 mm, clearance 0.27 mm
4 GND: width 0.2 mm
5 Battery: width 0.3 mm
6 FM Antenna: width 0.27 mm
7 VBUS: width 0.25 mm